# Altium project Power Board UCC28951.PrjPcb (part 1 of 4)
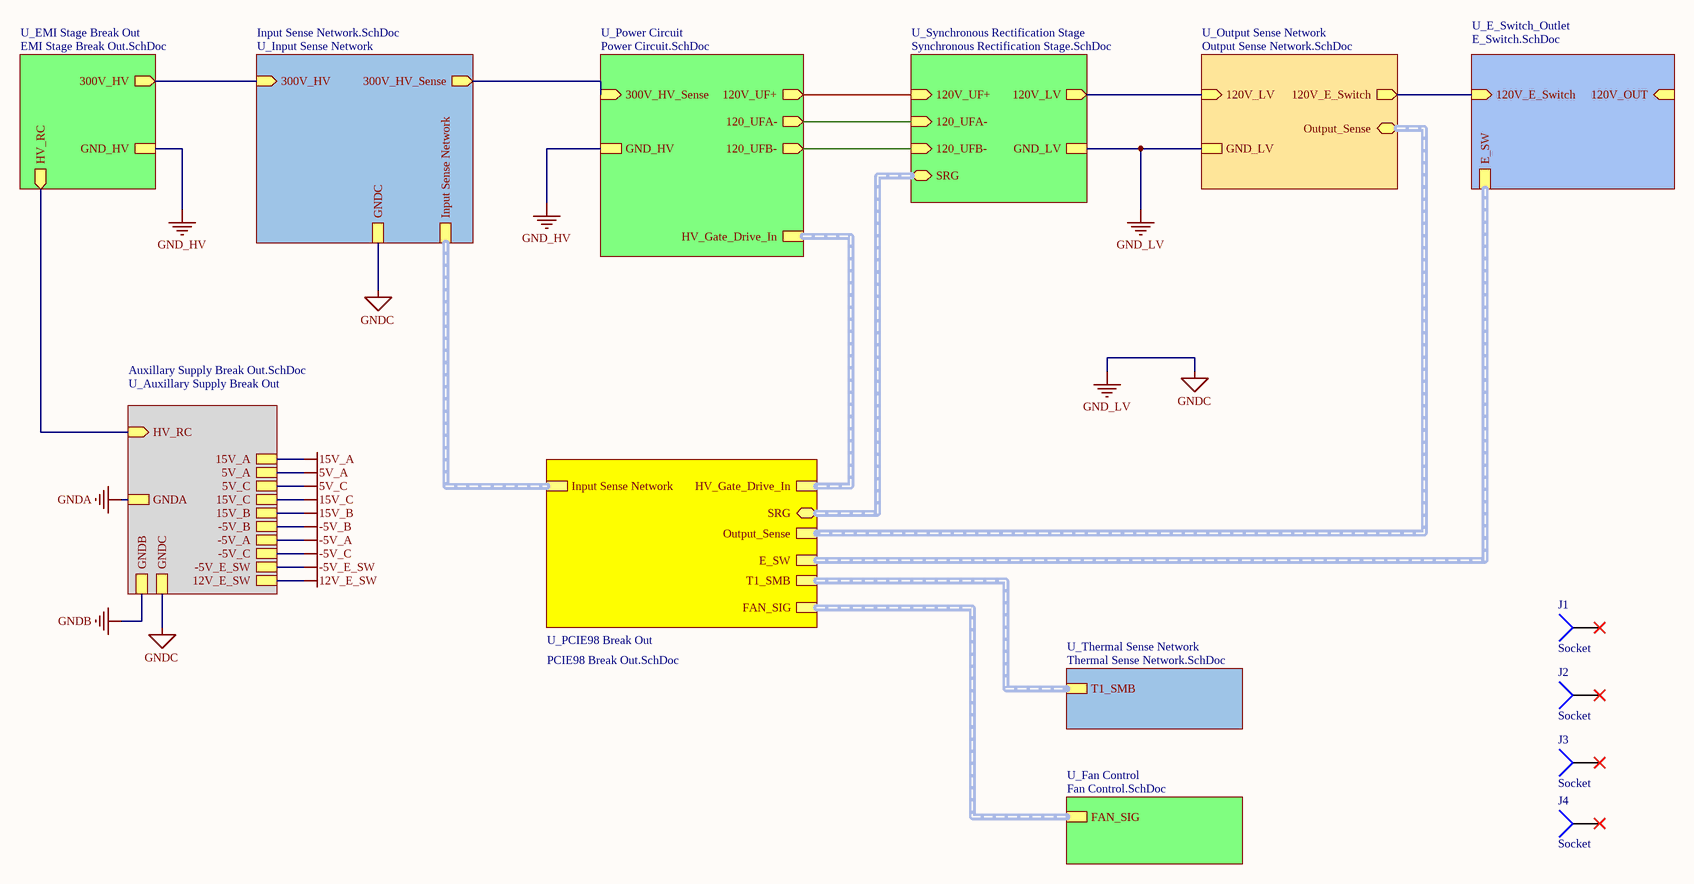
[diagram p0: Power Board UCC28951.SchDoc]
17 sheets, 569 parts. Net scope: hierarchical (ports join the sheet entries above them; power ports are global).
Board file: Power Board UCC28951.PcbDoc
Sheets:
  Power Board UCC28951.SchDoc
    U_Power Circuit = Power Circuit.SchDoc
      U_Gate Driver HV = Gate Driver HV.SchDoc
    U_PCIE98 Break Out = PCIE98 Break Out.SchDoc
    U_Auxillary Supply Break Out = Auxillary Supply Break Out.SchDoc
      U_5V_Isolated_Bias = 5V_Isolated_Bias.SchDoc
    U_EMI Stage Break Out = EMI Stage Break Out.SchDoc
    U_Thermal Sense Network = Thermal Sense Network.SchDoc
    U_Output Sense Network = Output Sense Network.SchDoc
      U_Output Current Sense = Output Current Sense.SchDoc
    U_Input Sense Network = Input Sense Network.SchDoc
      U_Input Current Sense = Input Current Sense.SchDoc
      U_Input Voltage Sense = Input Voltage Sense.SchDoc
    U_Synchronous Rectification Stage = Synchronous Rectification Stage.SchDoc
      U_Gate Driver Rectifier = Gate Driver Rectifier.SchDoc
    U_E_Switch_Outlet = E_Switch.SchDoc
    U_Fan Control = Fan Control.SchDoc

## Sheet Power Board UCC28951.SchDoc
size B

### Parts
J1  Socket  [Mounting_screw_3mm]
J2  Socket  [Mounting_screw_3mm]
J3  Socket  [Mounting_screw_3mm]
J4  Socket  [Mounting_screw_3mm]

### Sub-sheets
U_Auxillary Supply Break Out = Auxillary Supply Break Out.SchDoc: 15V_A, 5V_A, 15V_B, GNDB, GNDA, 5V_C, 15V_C, GNDC, -5V_B, -5V_A, -5V_C, -5V_E_SW, 12V_E_SW, HV_RC (in)
U_E_Switch_Outlet = E_Switch.SchDoc: 120V_E_Switch (in), 120V_OUT (in), E_SW (harness E_SW)
U_EMI Stage Break Out = EMI Stage Break Out.SchDoc: 300V_HV (out), GND_HV, HV_RC (out)
U_Fan Control = Fan Control.SchDoc: FAN_SIG (harness FAN_SIG)
U_Input Sense Network = Input Sense Network.SchDoc: 300V_HV (in), 300V_HV_Sense (out), GNDC, Input Sense Network (harness Input Sense Network)
U_Output Sense Network = Output Sense Network.SchDoc: 120V_LV (in), GND_LV, Output_Sense (bidir, harness Output_Sense), 120V_E_Switch (out)
U_PCIE98 Break Out = PCIE98 Break Out.SchDoc: Input Sense Network (harness Input Sense Network), HV_Gate_Drive_In (harness HV_Gate_Drive_In), SRG (bidir, harness SRG), Output_Sense (harness Output_Sense), E_SW (harness E_SW), T1_SMB (harness T1_SMB), FAN_SIG (harness FAN_SIG)
U_Power Circuit = Power Circuit.SchDoc: 300V_HV_Sense (in), GND_HV, 120V_UF+ (out), 120_UFA- (out), 120_UFB- (out), HV_Gate_Drive_In (harness HV_Gate_Drive_In)
U_Synchronous Rectification Stage = Synchronous Rectification Stage.SchDoc: 120V_UF+ (in), GND_LV, 120V_LV (out), 120_UFA- (in), 120_UFB- (in), SRG (bidir, harness SRG)
U_Thermal Sense Network = Thermal Sense Network.SchDoc: T1_SMB (harness T1_SMB)

### Nets
GND_HV: sheet U_Power Circuit/GND_HV, sheet U_EMI Stage Break Out/GND_HV
GND_LV: sheet U_Auxillary Supply Break Out/GNDC, sheet U_Output Sense Network/GND_LV, sheet U_Input Sense Network/GNDC, sheet U_Synchronous Rectification Stage/GND_LV  [also labelled GNDC]
120_UFA-: sheet U_Power Circuit/120_UFA-, sheet U_Synchronous Rectification Stage/120_UFA-
120_UFB-: sheet U_Power Circuit/120_UFB-, sheet U_Synchronous Rectification Stage/120_UFB-
120V_LV: sheet U_Power Circuit/120V_UF+, sheet U_Output Sense Network/120V_LV, sheet U_Synchronous Rectification Stage/120V_UF+, sheet U_Synchronous Rectification Stage/120V_LV
300V_HV: sheet U_EMI Stage Break Out/300V_HV, sheet U_Input Sense Network/300V_HV
300V_HV_Sense: sheet U_Power Circuit/300V_HV_Sense, sheet U_Input Sense Network/300V_HV_Sense
E_SW_Clamp: sheet U_Output Sense Network/120V_E_Switch, sheet U_E_Switch_Outlet/120V_E_Switch
HV_RC: sheet U_Auxillary Supply Break Out/HV_RC, sheet U_EMI Stage Break Out/HV_RC

Not connected (* = marked no-connect by the designer): J1 1*; J2 1*; J3 1*; J4 1*

### Buses and harness runs
harness  = sheet U_Input Sense Network/Input Sense Network = sheet U_PCIE98 Break Out/Input Sense Network
harness sheet U_E_Switch_Outlet/E_SW = sheet U_PCIE98 Break Out/E_SW
harness sheet U_Fan Control/FAN_SIG = sheet U_PCIE98 Break Out/FAN_SIG
harness sheet U_Output Sense Network/Output_Sense = sheet U_PCIE98 Break Out/Output_Sense
harness sheet U_PCIE98 Break Out/HV_Gate_Drive_In = sheet U_Power Circuit/HV_Gate_Drive_In
harness sheet U_PCIE98 Break Out/SRG = sheet U_Synchronous Rectification Stage/SRG
harness sheet U_PCIE98 Break Out/T1_SMB = sheet U_Thermal Sense Network/T1_SMB

### Library data of the parts
J1-J4 = Socket: LatestRevisionDate: 17-Jul-2002; LatestRevisionNote: Re-released for DXP Platform.; Publisher: Altium Limited

## Sheet Power Circuit.SchDoc
size A1
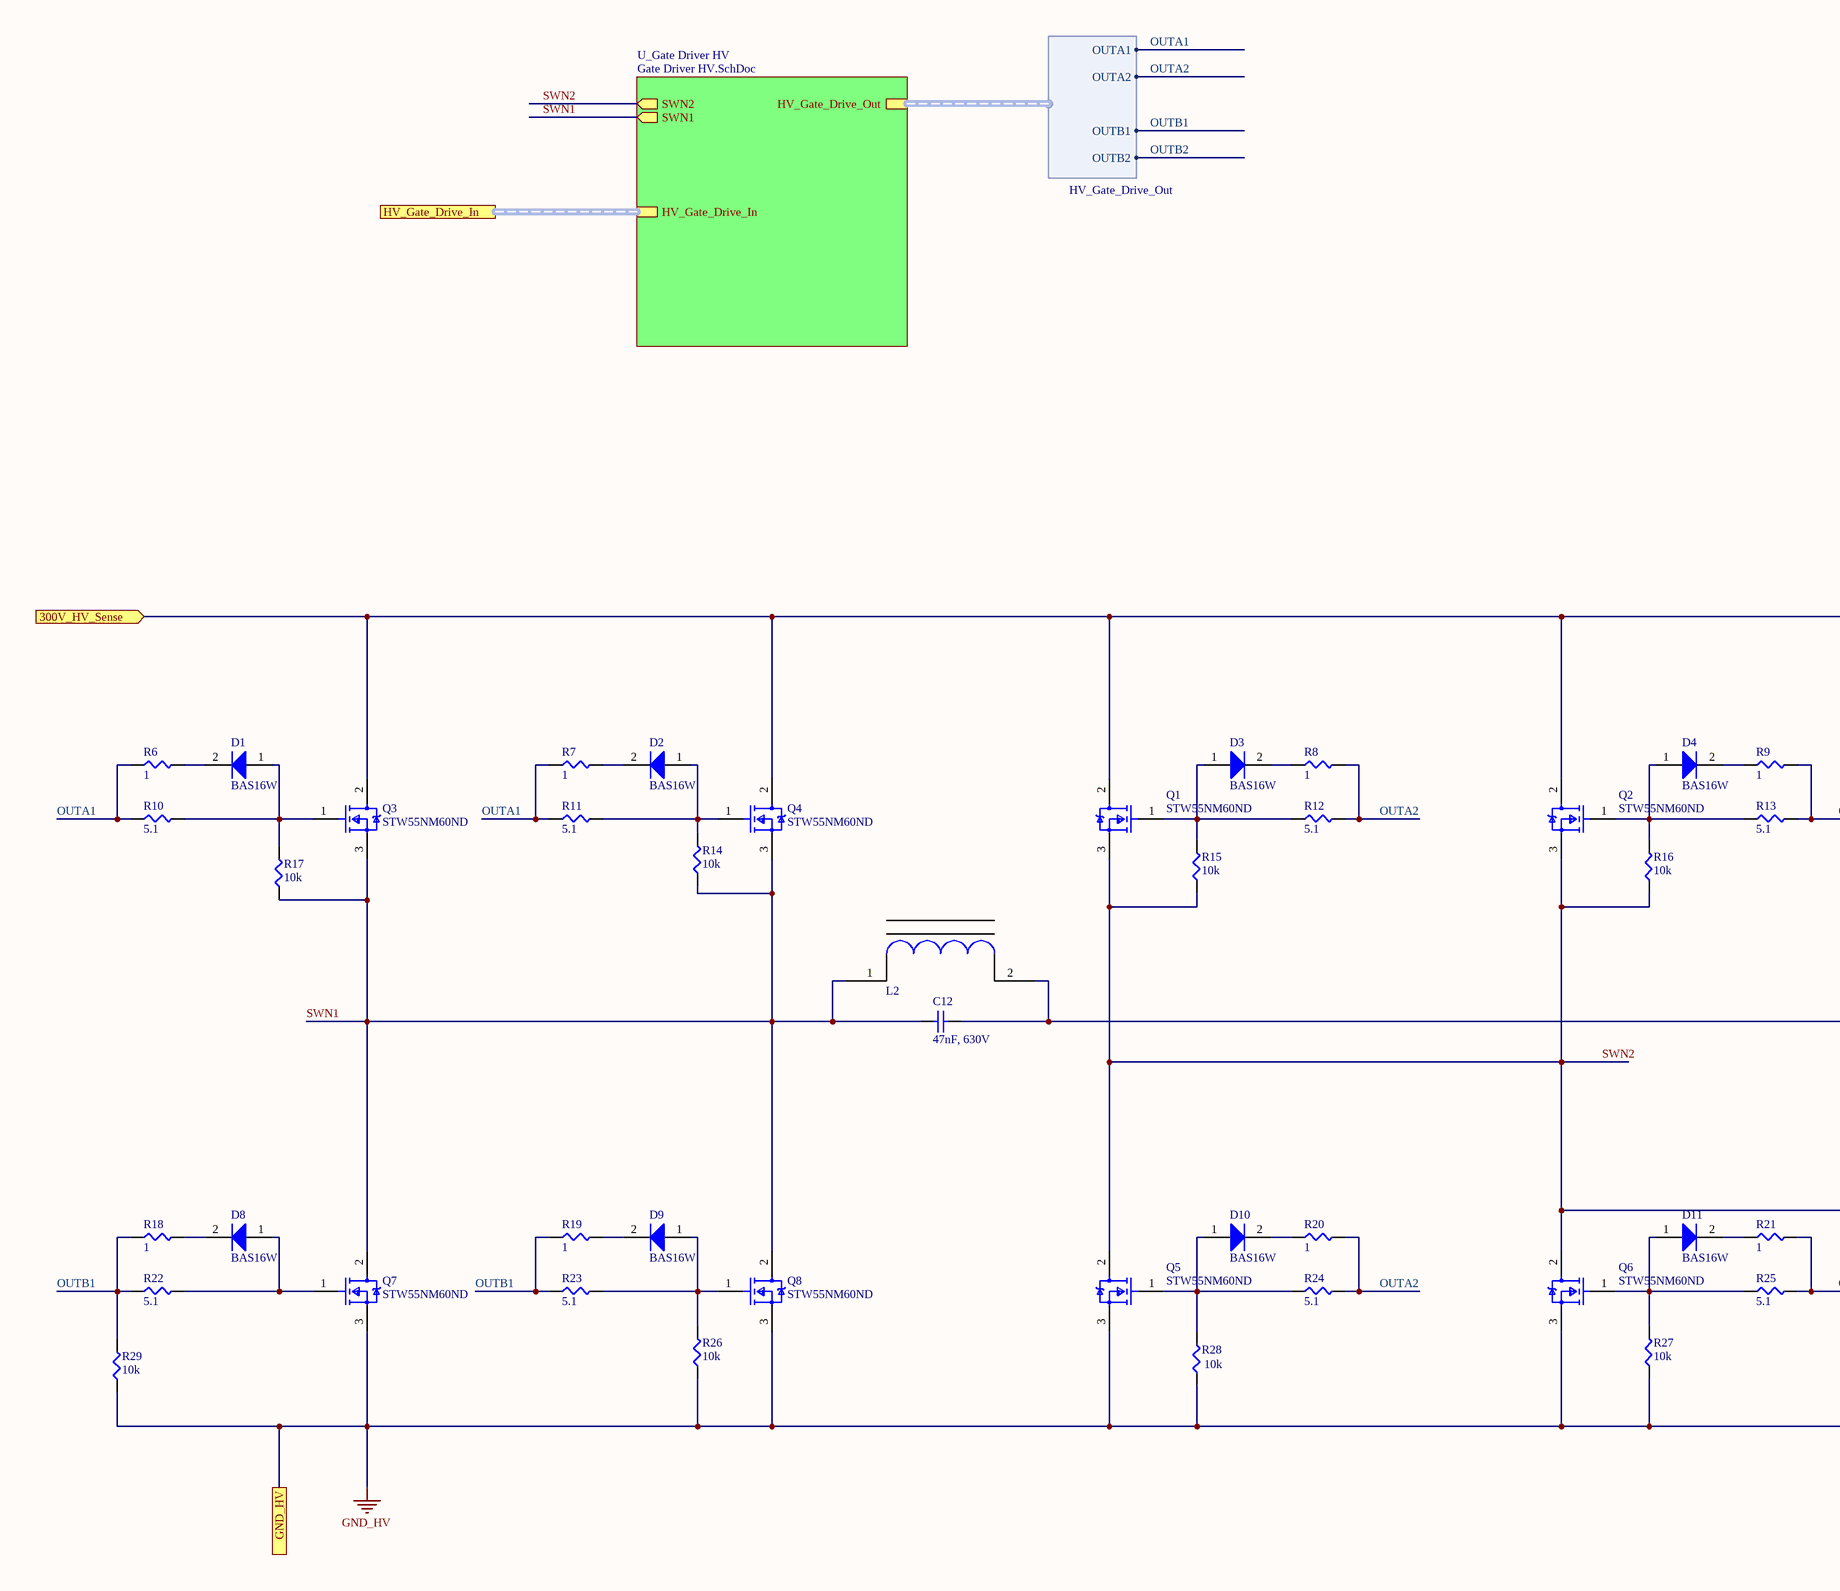
[diagram p1: Power Circuit.SchDoc, left]
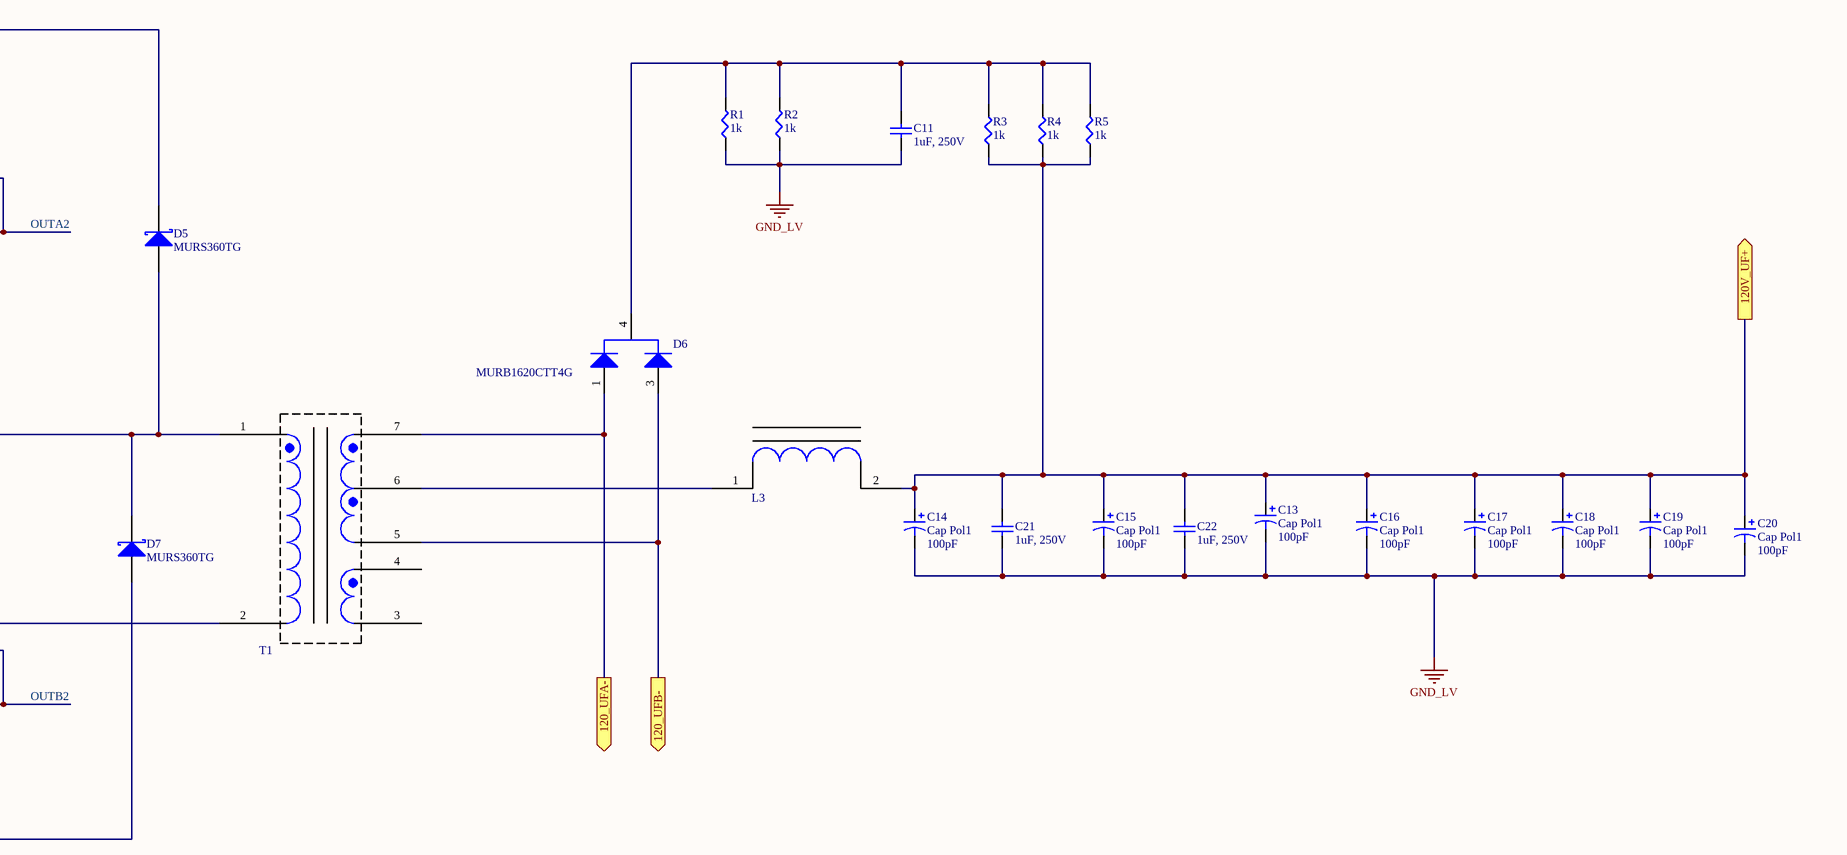
[diagram p2: Power Circuit.SchDoc, right]

### Parts
(Parts that share a designator on the sheet are numbered #1, #2 ... from top to bottom, then left to right.)
C11  1uF, 250V  [L18_W7_H13_P15]
C12  47nF, 630V  [L13_W5.5_H11_P10]
C13  Cap Pol1  value 100pF  [450V_25mm_Dia_10mm_pitch]
C14  Cap Pol1  value 100pF  [450V_25mm_Dia_10mm_pitch]
C15  Cap Pol1  value 100pF  [450V_25mm_Dia_10mm_pitch]
C16  Cap Pol1  value 100pF  [450V_25mm_Dia_10mm_pitch]
C17  Cap Pol1  value 100pF  [450V_25mm_Dia_10mm_pitch]
C18  Cap Pol1  value 100pF  [450V_25mm_Dia_10mm_pitch]
C19  Cap Pol1  value 100pF  [450V_25mm_Dia_10mm_pitch]
C20  Cap Pol1  value 100pF  [450V_25mm_Dia_10mm_pitch]
C21  1uF, 250V  [L18_W7_H13_P15]
C22  1uF, 250V  [L18_W7_H13_P15]
D1  BAS16W  [SODFL250X110-2N]
D2  BAS16W  [SODFL250X110-2N]
D3  BAS16W  [SODFL250X110-2N]
D4  BAS16W  [SODFL250X110-2N]
D5  MURS360TG  [VISH-DO-214AB-2_V]
D6  MURB1620CTT4G  [DPAK254P1542X450-3N - diode]
D7#1  MURS360TG  [VISH-DO-214AB-2_V]
D8  BAS16W  [SODFL250X110-2N]
D9  BAS16W  [SODFL250X110-2N]
D10  BAS16W  [SODFL250X110-2N]
D11  BAS16W  [SODFL250X110-2N]
L2  Transformer_Inductor  [Shim Inductor]  (value not drawn)
L3  Transformer_Inductor  [Toroid_54439_2]  (value not drawn)
Q1  STW55NM60ND  [FP-TO-247-0075325-MFG]
Q2  STW55NM60ND  [FP-TO-247-0075325-MFG]
Q3  STW55NM60ND  [FP-TO-247-0075325-MFG]
Q4  STW55NM60ND  [FP-TO-247-0075325-MFG]
Q5  STW55NM60ND  [FP-TO-247-0075325-MFG]
Q6  STW55NM60ND  [FP-TO-247-0075325-MFG]
Q7  STW55NM60ND  [FP-TO-247-0075325-MFG]
Q8  STW55NM60ND  [FP-TO-247-0075325-MFG]
R1  1k  [SMD-2512-RES]
R2  1k  [SMD-2512-RES]
R3  1k  [SMD-2512-RES]
R4  1k  [SMD-2512-RES]
R5  1k  [SMD-2512-RES]
R6  1  [SMD-0805-RES]
R7  1  [SMD-0805-RES]
R8  1  [SMD-0805-RES]
R9  1  [SMD-0805-RES]
R10  5.1  [SMD-1206-RES]
R11  5.1  [SMD-1206-RES]
R12  5.1  [SMD-1206-RES]
R13  5.1  [SMD-1206-RES]
R14  10k  [SMD-1206-RES]
R15  10k  [SMD-1206-RES]
R16  10k  [SMD-1206-RES]
R17  10k  [SMD-1206-RES]
R18  1  [SMD-0805-RES]
R19  1  [SMD-0805-RES]
R20  1  [SMD-0805-RES]
R21  1  [SMD-0805-RES]
R22  5.1  [SMD-1206-RES]
R23  5.1  [SMD-1206-RES]
R24  5.1  [SMD-1206-RES]
R25  5.1  [SMD-1206-RES]
R26  10k  [SMD-1206-RES]
R27  10k  [SMD-1206-RES]
R28  10k  [SMD-1206-RES]
R29  10k  [SMD-1206-RES]
T1  Transformer_Centre_Tap_Secondaru_Aux_1  [ETD59]  (value not drawn)

### Sub-sheets
U_Gate Driver HV = Gate Driver HV.SchDoc: HV_Gate_Drive_Out (harness HV_Gate_Drive_Out), HV_Gate_Drive_In (harness HV_Gate_Drive_In), SWN2 (out), SWN1 (out)

### Ports
120_UFA- (out), 120_UFB- (out), 120V_UF+ (out), 300V_HV_Sense (in), GND_HV, HV_Gate_Drive_In (harness HV_Gate_Drive_In)

### Harnesses
HV_Gate_Drive_Out: OUTA1, OUTA2, OUTB1, OUTB2

### Nets
GND_HV: D7#1.1(A) Q5.3(S) Q6.3(S) Q7.3(S) Q8.3(S) R26.1 R27.1 R28.1 R29.1 ; port GND_HV
GND_LV: C11.1 C13.2 C14.2 C15.2 C16.2 C17.2 C18.2 C19.2 C20.2 C21.1 C22.1 R1.1 R2.1
120_UFA-: D6.1(A1) T1.7 ; port 120_UFA-
120_UFB-: D6.3(A2) T1.5 ; port 120_UFB-
120V_LV: C13.1 C14.1 C15.1 C16.1 C17.1 C18.1 C19.1 C20.1 C21.2 C22.2 L3.2 R3.1 R4.1 R5.1 ; port 120V_UF+
300V_HV_Sense: D5.2(K) Q1.2(D) Q2.2(D) Q3.2(D) Q4.2(D) ; port 300V_HV_Sense
OUTA1: R6.1 R7.1 R10.1 R11.1 ; sheet U_Gate Driver HV/HV_Gate_Drive_Out.OUTA1
OUTA2: R8.2 R9.2 R12.2 R13.2 R20.2 R24.2 ; sheet U_Gate Driver HV/HV_Gate_Drive_Out.OUTA2
OUTB1: R18.1 R19.1 R22.1 R23.1 R29.2 ; sheet U_Gate Driver HV/HV_Gate_Drive_Out.OUTB1
OUTB2: R21.2 R25.2 ; sheet U_Gate Driver HV/HV_Gate_Drive_Out.OUTB2
SWN1: C12.1 L2.1 Q3.3(S) Q4.3(S) Q7.2(D) Q8.2(D) R14.1 R17.1 ; sheet U_Gate Driver HV/SWN1
SWN2: Q1.3(S) Q2.3(S) Q5.2(D) Q6.2(D) R15.1 R16.1 T1.2 ; sheet U_Gate Driver HV/SWN2
NetC11_2: C11.2 D6.4(K) R1.2 R2.2 R3.2 R4.2 R5.2
NetC12_2: C12.2 D5.1(A) D7#1.2(K) L2.2 T1.1
NetD1_1: D1.1(A) Q3.1(G) R10.2 R17.2
NetD1_2: D1.2(K) R6.2
NetD2_1: D2.1(A) Q4.1(G) R11.2 R14.2
NetD2_2: D2.2(K) R7.2
NetD3_1: D3.1(A) Q1.1(G) R12.1 R15.2
NetD3_2: D3.2(K) R8.1
NetD4_1: D4.1(A) Q2.1(G) R13.1 R16.2
NetD4_2: D4.2(K) R9.1
NetD8_1: D8.1(A) Q7.1(G) R22.2
NetD8_2: D8.2(K) R18.2
NetD9_1: D9.1(A) Q8.1(G) R23.2 R26.2
NetD9_2: D9.2(K) R19.2
NetD10_1: D10.1(A) Q5.1(G) R24.1 R28.2
NetD10_2: D10.2(K) R20.1
NetD11_1: D11.1(A) Q6.1(G) R25.1 R27.2
NetD11_2: D11.2(K) R21.1
NetL3_1: L3.1 T1.6

Not connected (* = marked no-connect by the designer): T1 3 4

### Buses and harness runs
harness port HV_Gate_Drive_In = sheet U_Gate Driver HV/HV_Gate_Drive_In

### Library data of the parts
C11 C21 C22 = 890273425007CS: WCAP-FTBE THT Film Capacitors, 1uF, 250VDC; Insulation Resistance: 3000Ohm x F; Dissipation Factor@100kHz: 4.3%; Dissipation Factor@1kHz: 1%; Dissipation Factor@10kHz: 1.5%; Pitch: 15mm; Rate of Voltage Rise: 11V/us; Technical Reference: MPSP015105K250DCPP45004; ComponentLink1Description: Manufacturer; ComponentLink1URL: http://www.we-online.de; ComponentLink2Description: Datasheet; ComponentLink2URL: https://katalog.we-online.com/pbs/datasheet/890273425007CS.pdf; Length: 18mm; Mounting Technology: THT; Packaging: Carton; Part Number: 890273425007CS; Operating Temperature: -40 to +85degC; Width: 7mm; Capacitance: 1uF; Height: 13mm; Rated Voltage: 250VDC; Publisher: Wurth Elektronik; Published Date: August 2019
C12 = 890303323004CS: WCAP-FTBP THT Film Capacitors, 47nF, 630VDC; Insulation Resistance: 30000MOhm; Dissipation Factor@100kHz: 0.29%; Dissipation Factor@1kHz: 0.1%; Dissipation Factor@10kHz: 10%; Pitch: 10mm; Rate of Voltage Rise: 430V/us; Technical Reference: MPPP010473J630DCPP55004; ComponentLink1Description: Manufacturer; ComponentLink1URL: http://www.we-online.de; ComponentLink2Description: Datasheet; ComponentLink2URL: https://katalog.we-online.com/pbs/datasheet/890303323004CS.pdf; Length: 13mm; Mounting Technology: THT; Packaging: Carton; Part Number: 890303323004CS; Operating Temperature: -40 to +105degC; Width: 5.5mm; Capacitance: 47nF; Height: 11mm; Rated Voltage: 630VDC; Publisher: Wurth Elektronik; Published Date: August 2019
C13-C20 = Cap Pol1: Polarized Capacitor (Radial); Published: 8-Jun-2000; LatestRevisionDate: 17-Jul-2002; LatestRevisionNote: Re-released for DXP Platform.; PackageReference: RB7.6-15; Publisher: Altium Limited; PackageDescription: Polarized Capacitor (Radial); 2 Leads
D1-D4 D8-D11 = BAS16_SOD: Silicon Switching Diode, SOT323, Reel, Green; Manufacturer: Infineon; IR (max): 100Â nA; Configuration: Single; VBR (min): 85Â V; VR (max): 80Â V; trr (max): 4Â ns; Green: TRUE; VF (max): 1.25Â V; IF (max): 250Â mA; Mounting Technology: Surface Mount; PackageReference: SOT323; ComponentLink2URL: http://www.infineon.com/dgdl/bas16series.pdf?folderId=db3a30431400ef6801141b5844e103ea&fileId=db3a30431400ef6801141b93811b03ff; Halogen-free: TRUE; ComponentLink2Description: Datasheet; PartNumber: BAS16W; ComponentLink1Description: Manufacturer URL; ComponentLink3URL: http://www.infineon.com/dgdl/SOT323-Package_Overview.pdf?folderId=db3a30431936bc4b0119533e1dcb3c92&fileId=db3a30431936bc4b011953495f283cb1; ComponentLink1URL: http://www.infineon.com/; PackageDescription: 3-Pin Small Outline Transistor Package, 1.25 x 2 mm Body, 0.65 mm Pitch; ComponentLink3Description: Package Specification
D5 D7#1 = CMP-2000-07150-1: Surface Mount Schottky Barrier Rectifier, 600 V, 3 A, -55 to 150 degC, 2-Pin SMC (DO-214AB), RoHS, Tape and Reel; Manufacturer: Vishay; Forward Current If(AV): 3A; Diode Configuration: Single; Forward Surge Current Ifsm Max: 100A; SVHC: ToBeAdvised; No. of Pins: 2Pins; Forward Voltage VF Max: 750mV; Repetitive Reverse Voltage Vrrm Max: 60V; Datasheet URL: http://www.vishay.com/docs/88751/ss32.pdf; Datasheet Version: 08/2015; Manufacturer URL: http://www.vishay.com/; Diode Type: Schottky; Package Reference: DO-214AB; Mounting Technology: SurfaceMount; Diode Case Style: DO-214AB; Package Description: 2-Pin Surface Mount Device, Body 6.855 x 5.905 mm; Packaging: CutTape; Operating Temperature Max: 150°C; Product Range: -
D6 = CMP-0902-00228-1: SWITCHMODE(TM) Power Rectifier, 3-Pin D2PAK, Pb-Free, Tape and Reel; Manufacturer: On Semiconductor; IFSM Max (A): 100; VRRM Max (V): 200; Type: Ultrafast; ComponentLink2URL: http://www.onsemi.cn/pub_link/Collateral/MURB1620CT-D.PDF; Mounting Technology: Surface Mount; PackageReference: D2PAK-3-418B-04; PackageDescription: 3-Pin Flange Mount, Body 9.145 x 9.97 mm, Pitch 2.54 mm; PackageVersion: Rev. K, 09/2008; RoHS: TRUE; PartNumber: MURB1620CTT4G; Packing: Tape and Reel; ComponentLink1URL: http://www.onsemi.com/; ComponentLink3Description: Package Specification; ComponentLink3URL: http://www.onsemi.com/pub_link/Collateral/418B-04.PDF; DatasheetVersion: Rev. 7; ComponentLink2Description: Datasheet; ComponentLink1Description: Manufacturer URL
Q1-Q8 = CMP-12198-000021-1: MOSFET N-CH 600V 51A TO-247; Obsolete Part: true; Manufacturer: STMicroelectronics; Max Forward Diode Voltage: 1.3V; Drain To Source Resistance: 0.047Ω; Turn Off Delay Time: 188ns; Threshold Vgs Min: 3V; Rthja Max: 50°C/W; Threshold Vgs Max: 5V; Transconductance: 45S; Depletion Mode: False; Turn On Delay Time: 33ns; Gate Charge At Vgs: 190nC @ 10V; Standoff Height: 3.7mm; Number Of Channels: 1; Gate To Source Voltage: 25V; Max Junction Temp: +150°C; Reverse Recovery Time: 200ns; Reverse Recovery Charge: 1800nC; Pulse Drain Current: 204A; Input Capacitace At Vds: 5800pF @ 50V; Power Dissipation: 350W; Automotive: No; RoHS: TRUE; Continuous Drain Current: 51A; ComponentLink2Description: Datasheet; Digikey Description: MOSFET N-CH 600V 51A TO-247; Device Class L1: Discrete Semiconductors; Package: TO-247-0075325; Height: 24.45mm; Manufacturer Part Number: STW55NM60ND; Drain To Source Voltage: 600V; ComponentLink2URL: https://www.mouser.in/datasheet/2/389/en.CD00176812-1218252.pdf; Temperature Range High: +150°C; Octopart: https://octopart.com/stw55nm60nd-stmicroelectronics-8600607; Category: Trans; Device Class L3: MOSFETs; Ipc Land Pattern Name: TO-220; Device Class L2: Transistors; Drain To Source Breakdown Voltage: 600V; Lead Free: Yes; Temperature: to +150°C; Mouser Description: MOSFET N-channel 600 V FDMesh; Number Of N Channels: 1
R1-R5 = ERJ-1TNF1001U: RES SMD 1K OHM 1% 1W 2512; Manufacturer: Panasonic Electronic Components; Factory Stock: 0; Unit Price (USD): 0.14799; @ qty: 1500; Minimum Quantity: 1; Temperature Coefficient: ±100ppm/°C; Part Number: ERJ-1TNF1001U; Datasheets: http://industrial.panasonic.com/www-cgi/jvcr13pz.cgi?E+PZ+3+AOA0002+ERJ1TNF1001U+7+WW; Image: //media.digikey.com/Renders/Panasonic%20Renders/ERJ-2512%20Pkg.jpg; Digi-Key Part Number: PT1.00KAFCT-ND; Quantity Available: 16384; Packaging: Cut Tape (CT); Series: ERJ; Part Status: Active; Value: 1k; Tolerance: ±1%; Power (Watts): 1W; Composition: Thick Film; Features: Automotive AEC-Q200; Operating Temperature: -55°C ~ 155°C; Package / Case: 2512 (6432 Metric); Supplier Device Package: 2512; Size / Dimension: 0.252" L x 0.126" W (6.40mm x 3.20mm); Height - Seated (Max): 0.028" (0.70mm); Number of Terminations: 2; Failure Rate: -
R6-R9 R18-R21 = ERJ-6BQF1R0V: RES SMD 1 OHM 1% 1/3W 0805; Manufacturer: Panasonic Electronic Components; Factory Stock: 0; Unit Price (USD): 0.05834; @ qty: 1500; Power (Watts): 0.333W, 1/3W; Temperature Coefficient: ±200ppm/°C; Part Number: ERJ-6BQF1R0V; Datasheets: https://industrial.panasonic.com/cdbs/www-data/pdf/RDA0000/AOA0000C239.pdf; Image: //media.digikey.com/Renders/Panasonic%20Renders/ERJ-0805%20Pkg.jpg; Digi-Key Part Number: P17499CT-ND; Quantity Available: 808; Minimum Quantity: 1; Packaging: Cut Tape (CT); Series: ERJ; Part Status: Active; Value: 1; Tolerance: ±1%; Composition: Thick Film; Features: Automotive AEC-Q200, Current Sense; Operating Temperature: -55°C ~ 125°C; Package / Case: 0805 (2012 Metric); Supplier Device Package: 0805; Size / Dimension: 0.079" L x 0.049" W (2.00mm x 1.25mm); Height - Seated (Max): 0.028" (0.70mm); Number of Terminations: 2; Failure Rate: -
R10-R13 R22-R25 = ERJ-8BQF5R1V: RES SMD 5.1 OHM 1% 1/2W 1206; Manufacturer: Panasonic Electronic Components; Factory Stock: 0; Unit Price (USD): 0.05778; @ qty: 1500; Minimum Quantity: 1; Power (Watts): 0.5W, 1/2W; Temperature Coefficient: ±200ppm/°C; Part Number: ERJ-8BQF5R1V; Datasheets: https://industrial.panasonic.com/cdbs/www-data/pdf/RDA0000/AOA0000C239.pdf; Image: //media.digikey.com/Renders/Panasonic%20Renders/ERJ-1206%20Pkg.jpg; Digi-Key Part Number: P17617CT-ND; Quantity Available: 4802; Packaging: Cut Tape (CT); Series: ERJ; Part Status: Active; Value: 5.1; Tolerance: ±1%; Composition: Thick Film; Features: Automotive AEC-Q200, Current Sense; Operating Temperature: -55°C ~ 125°C; Package / Case: 1206 (3216 Metric); Supplier Device Package: 1206; Size / Dimension: 0.126" L x 0.063" W (3.20mm x 1.60mm); Height - Seated (Max): 0.028" (0.70mm); Number of Terminations: 2; Failure Rate: -
R14-R17 R26-R29 = ERJ-8ENF1002V: RES SMD 10K OHM 1% 1/4W 1206; Manufacturer: Panasonic Electronic Components; Factory Stock: 0; Unit Price (USD): 0.00933; @ qty: 1500; Minimum Quantity: 1; Power (Watts): 0.25W, 1/4W; Temperature Coefficient: ±100ppm/°C; Part Number: ERJ-8ENF1002V; Datasheets: http://industrial.panasonic.com/www-cgi/jvcr13pz.cgi?E+PZ+3+AOA0002+ERJ8ENF1002V+7+WW; Image: //media.digikey.com/Renders/Panasonic%20Renders/ERJ-1206%20Pkg.jpg; Digi-Key Part Number: P10.0KFCT-ND; Quantity Available: 1108398; Packaging: Cut Tape (CT); Series: ERJ; Part Status: Active; Value: 10k; Tolerance: ±1%; Composition: Thick Film; Features: Automotive AEC-Q200; Operating Temperature: -55°C ~ 155°C; Package / Case: 1206 (3216 Metric); Supplier Device Package: 1206; Size / Dimension: 0.126" L x 0.063" W (3.20mm x 1.60mm); Height - Seated (Max): 0.028" (0.70mm); Number of Terminations: 2; Failure Rate: -

## Sheet Gate Driver HV.SchDoc
size A2
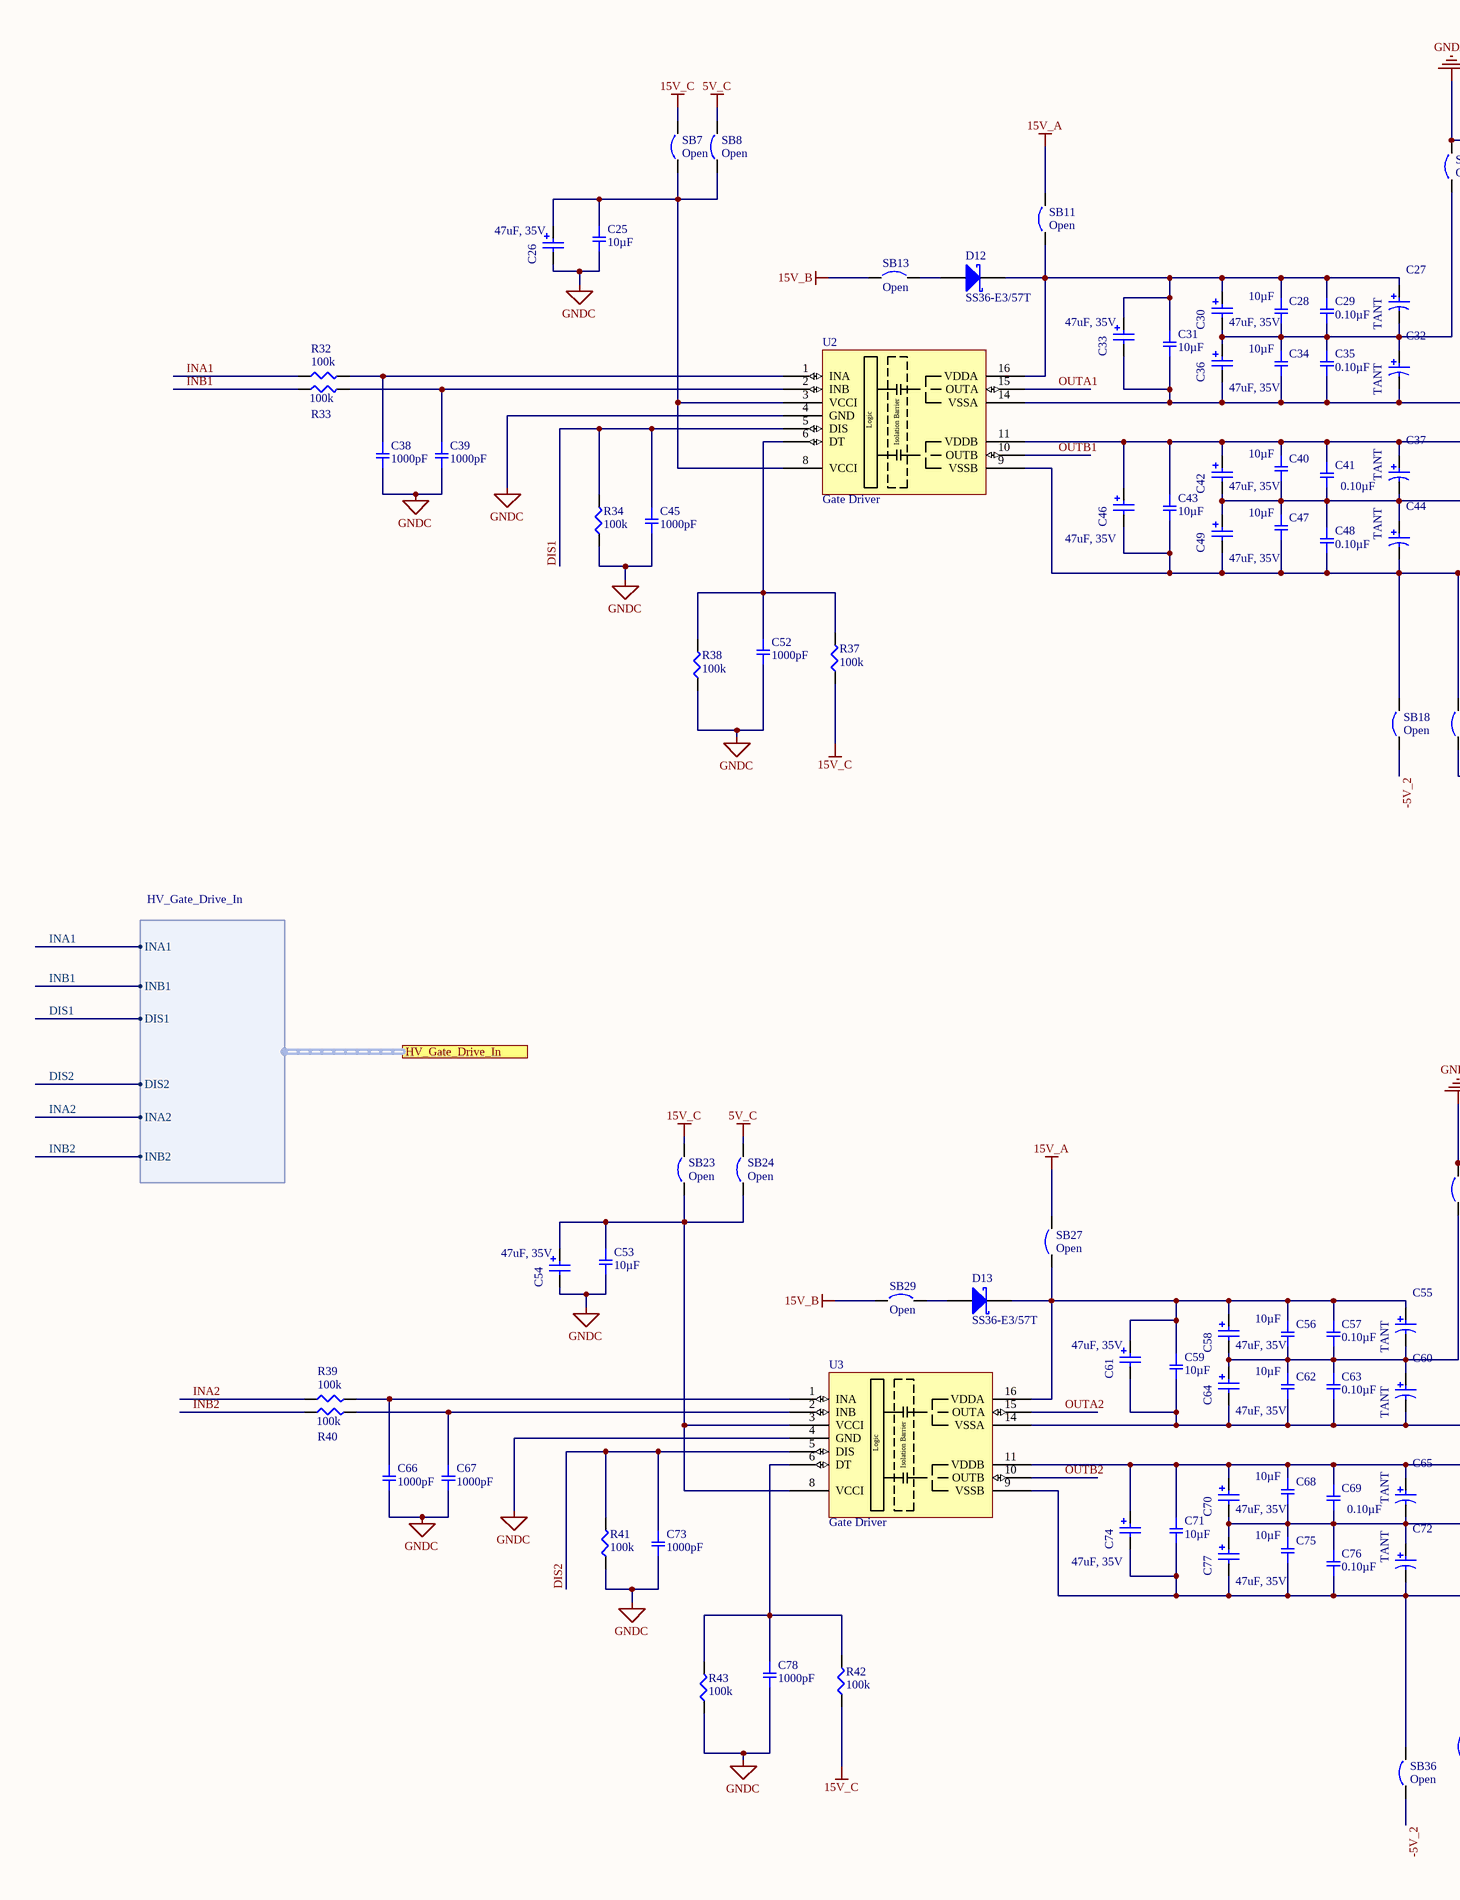
[diagram p3: Gate Driver HV.SchDoc, left]
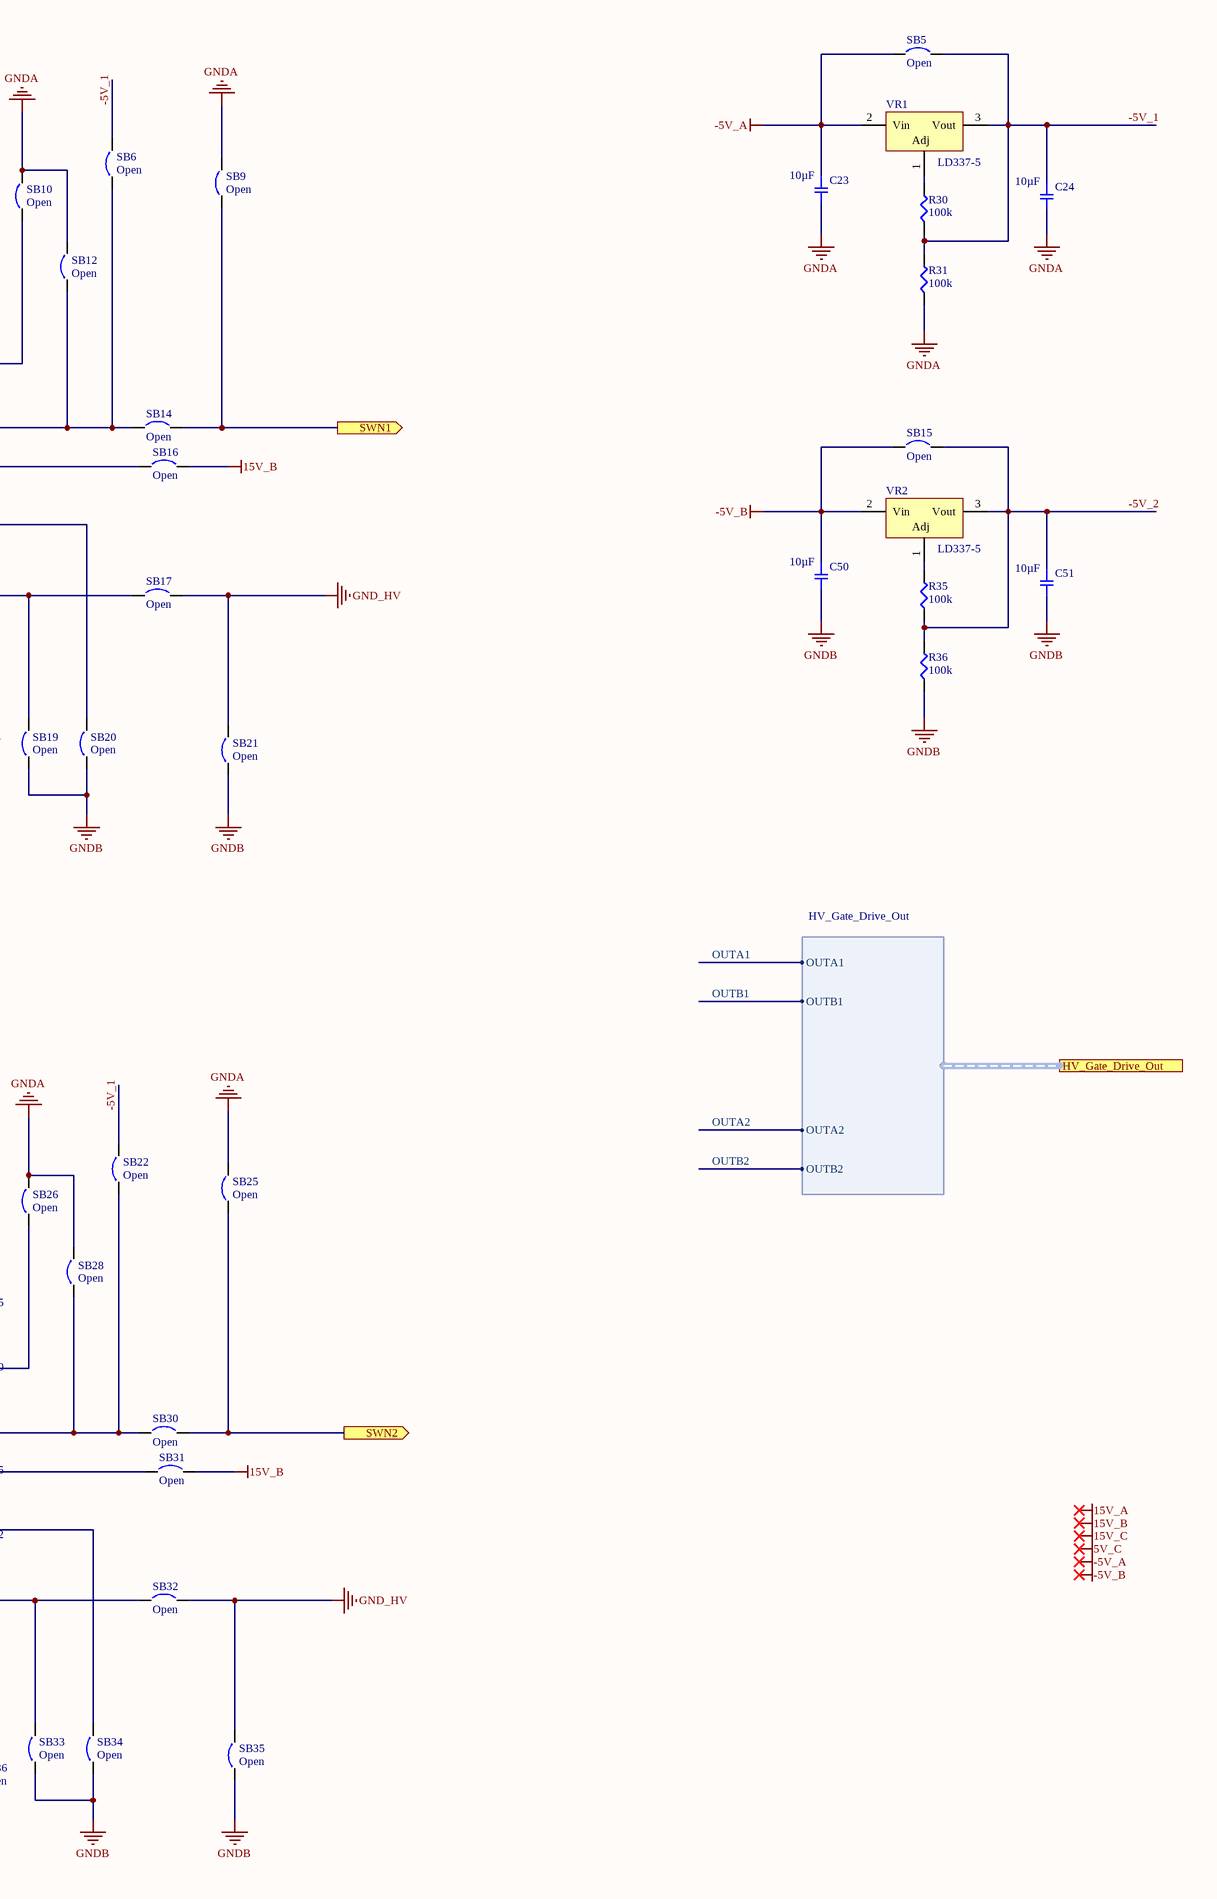
[diagram p4: Gate Driver HV.SchDoc, right]

### Parts
C23  10µF  [SMD-1206C]
C24  10µF  [SMD-1206C]
C25  10µF  [SMD-1206C]
C26  47uF, 35V  [WCAP-ASLL_6.3x5.5]
C27  TANT  [KEMT-T491-D_L]
C28  10µF  [SMD-1206C]
C29  0.10µF  [SMD-1206C]
C30  47uF, 35V  [WCAP-ASLL_6.3x5.5]
C31  10µF  [SMD-1206C]
C32  TANT  [KEMT-T491-D_L]
C33  47uF, 35V  [WCAP-ASLL_6.3x5.5]
C34  10µF  [SMD-1206C]
C35  0.10µF  [SMD-1206C]
C36  47uF, 35V  [WCAP-ASLL_6.3x5.5]
C37  TANT  [KEMT-T491-D_L]
C38  1000pF  [SMD-0805C]
C39  1000pF  [SMD-0805C]
C40  10µF  [SMD-1206C]
C41  0.10µF  [SMD-1206C]
C42  47uF, 35V  [WCAP-ASLL_6.3x5.5]
C43  10µF  [SMD-1206C]
C44  TANT  [KEMT-T491-D_L]
C45  1000pF  [SMD-0805C]
C46  47uF, 35V  [WCAP-ASLL_6.3x5.5]
C47  10µF  [SMD-1206C]
C48  0.10µF  [SMD-1206C]
C49  47uF, 35V  [WCAP-ASLL_6.3x5.5]
C50  10µF  [SMD-1206C]
C51  10µF  [SMD-1206C]
C52  1000pF  [SMD-0805C]
C53  10µF  [SMD-1206C]
C54  47uF, 35V  [WCAP-ASLL_6.3x5.5]
C55  TANT  [KEMT-T491-D_L]
C56  10µF  [SMD-1206C]
C57  0.10µF  [SMD-1206C]
C58  47uF, 35V  [WCAP-ASLL_6.3x5.5]
C59  10µF  [SMD-1206C]
C60  TANT  [KEMT-T491-D_L]
C61  47uF, 35V  [WCAP-ASLL_6.3x5.5]
C62  10µF  [SMD-1206C]
C63  0.10µF  [SMD-1206C]
C64  47uF, 35V  [WCAP-ASLL_6.3x5.5]
C65  TANT  [KEMT-T491-D_L]
C66  1000pF  [SMD-0805C]
C67  1000pF  [SMD-0805C]
C68  10µF  [SMD-1206C]
C69  0.10µF  [SMD-1206C]
C70  47uF, 35V  [WCAP-ASLL_6.3x5.5]
C71  10µF  [SMD-1206C]
C72  TANT  [KEMT-T491-D_L]
C73  1000pF  [SMD-0805C]
C74  47uF, 35V  [WCAP-ASLL_6.3x5.5]
C75  10µF  [SMD-1206C]
C76  0.10µF  [SMD-1206C]
C77  47uF, 35V  [WCAP-ASLL_6.3x5.5]
C78  1000pF  [SMD-0805C]
D12  SS36-E3/57T  [VISH-DO-214AB-2_V]
D13  SS36-E3/57T  [VISH-DO-214AB-2_V]
R30  100k  [SMD-0805-RES]
R31  100k  [SMD-0805-RES]
R32  100k  [SMD-0805-RES]
R33  100k  [SMD-0805-RES]
R34  100k  [SMD-0805-RES]
R35  100k  [SMD-0805-RES]
R36  100k  [SMD-0805-RES]
R37  100k  [SMD-0805-RES]
R38  100k  [SMD-0805-RES]
R39  100k  [SMD-0805-RES]
R40  100k  [SMD-0805-RES]
R41  100k  [SMD-0805-RES]
R42  100k  [SMD-0805-RES]
R43  100k  [SMD-0805-RES]
SB5  Open  [SB_0603]  (no BOM)
SB6  Open  [SB_0603]  (no BOM)
SB7  Open  [SB_0603]  (no BOM)
SB8  Open  [SB_0603]  (no BOM)
SB9  Open  [SB_0603]  (no BOM)
SB10  Open  [SB_0603]  (no BOM)
SB11  Open  [SB_0603]  (no BOM)
SB12  Open  [SB_0603]  (no BOM)
SB13  Open  [SB_0603]  (no BOM)
SB14  Open  [SB_0603]  (no BOM)
SB15  Open  [SB_0603]  (no BOM)
SB16  Open  [SB_0603]  (no BOM)
SB17  Open  [SB_0603]  (no BOM)
SB18  Open  [SB_0603]  (no BOM)
SB19  Open  [SB_0603]  (no BOM)
SB20  Open  [SB_0603]  (no BOM)
SB21  Open  [SB_0603]  (no BOM)
SB22  Open  [SB_0603]  (no BOM)
SB23  Open  [SB_0603]  (no BOM)
SB24  Open  [SB_0603]  (no BOM)
SB25  Open  [SB_0603]  (no BOM)
SB26  Open  [SB_0603]  (no BOM)
SB27  Open  [SB_0603]  (no BOM)
SB28  Open  [SB_0603]  (no BOM)
SB29  Open  [SB_0603]  (no BOM)
SB30  Open  [SB_0603]  (no BOM)
SB31  Open  [SB_0603]  (no BOM)
SB32  Open  [SB_0603]  (no BOM)
SB33  Open  [SB_0603]  (no BOM)
SB34  Open  [SB_0603]  (no BOM)
SB35  Open  [SB_0603]  (no BOM)
SB36  Open  [SB_0603]  (no BOM)
U2  Gate Driver  [SOIC127P1030X265_HS-17N]
U3  Gate Driver  [SOIC127P1030X265_HS-17N]
VR1  LD337-5  [SOT230P700X180-4N]
VR2  LD337-5  [SOT230P700X180-4N]

### Ports
HV_Gate_Drive_In (harness HV_Gate_Drive_In), HV_Gate_Drive_Out (harness HV_Gate_Drive_Out), SWN1 (out), SWN2 (out)

### Harnesses
HV_Gate_Drive_Out: OUTA1, OUTB1, OUTA2, OUTB2
HV_Gate_Drive_In: INA1, INB1, INA2, INB2, DIS2, DIS1

### Nets
5V_C: SB8.2 SB24.2
15V_A: SB11.2 SB27.2
15V_B: SB13.1 SB16.2 SB29.1 SB31.2
15V_C: R37.1 R42.1 SB7.2 SB23.2
-5V_A: C23.1 SB5.1 VR1.2(Vin)
-5V_B: C50.1 SB15.1 VR2.2(Vin)
GND_HV: SB17.2 SB21.2 SB32.2 SB35.2
GNDA: C23.2 C24.2 R31.1 SB9.2 SB10.2 SB12.2 SB25.2 SB26.2 SB28.2
GNDB: C50.2 C51.2 R36.1 SB19.1 SB20.1 SB21.1 SB33.1 SB34.1 SB35.1
GNDC: C25.2 C26.1(N) C38.2 C39.2 C45.2 C52.2 C53.2 C54.1(N) C66.2 C67.2 C73.2 C78.2 R34.1 R38.1 R41.1 R43.1 U2.4(GND) U3.4(GND)  [project net GND_LV]
-5V_1: C24.1 R30.1 R31.2 SB5.2 SB6.2 SB22.2 VR1.3(Vout)
-5V_2: C51.1 R35.1 R36.2 SB15.2 SB18.1 SB36.1 VR2.3(Vout)
DIS1: C45.1 R34.2 U2.5(DIS) ; port HV_Gate_Drive_In.DIS1
DIS2: C73.1 R41.2 U3.5(DIS) ; port HV_Gate_Drive_In.DIS2
INA1: R32.1 ; port HV_Gate_Drive_In.INA1
INA2: R39.1 ; port HV_Gate_Drive_In.INA2
INB1: R33.1 ; port HV_Gate_Drive_In.INB1
INB2: R40.1 ; port HV_Gate_Drive_In.INB2
OUTA1: U2.15(OUTA) ; port HV_Gate_Drive_Out.OUTA1
OUTA2: U3.15(OUTA) ; port HV_Gate_Drive_Out.OUTA2
OUTB1: U2.10(OUTB) ; port HV_Gate_Drive_Out.OUTB1
OUTB2: U3.10(OUTB) ; port HV_Gate_Drive_Out.OUTB2
SWN1: SB9.1 SB14.2 ; port SWN1
SWN2: SB25.1 SB30.2 ; port SWN2
NetC25_1: C25.1 C26.2(P) SB7.1 SB8.1 U2.3(VCCI) U2.8(VCCI)
NetC27_1: C27.1 C28.1 C29.1 C30.2(P) C31.1 C33.2(P) D12.2(K) SB11.1 U2.16(VDDA)
NetC27_2: C27.2 C28.2 C29.2 C30.1(N) C32.1 C34.1 C35.1 C36.2(P) SB10.1
NetC31_2: C31.2 C32.2 C33.1(N) C34.2 C35.2 C36.1(N) SB6.1 SB12.1 SB14.1 U2.14(VSSA)
NetC37_1: C37.1 C40.1 C41.1 C42.2(P) C43.1 C46.2(P) SB16.1 U2.11(VDDB)
NetC37_2: C37.2 C40.2 C41.2 C42.1(N) C44.1 C47.1 C48.1 C49.2(P) SB20.2
NetC38_1: C38.1 R32.2 U2.1(INA)
NetC39_1: C39.1 R33.2 U2.2(INB)
NetC43_2: C43.2 C44.2 C46.1(N) C47.2 C48.2 C49.1(N) SB17.1 SB18.2 SB19.2 U2.9(VSSB)
NetC52_1: C52.1 R37.2 R38.2 U2.6(DT)
NetC53_1: C53.1 C54.2(P) SB23.1 SB24.1 U3.3(VCCI) U3.8(VCCI)
NetC55_1: C55.1 C56.1 C57.1 C58.2(P) C59.1 C61.2(P) D13.2(K) SB27.1 U3.16(VDDA)
NetC55_2: C55.2 C56.2 C57.2 C58.1(N) C60.1 C62.1 C63.1 C64.2(P) SB26.1
NetC59_2: C59.2 C60.2 C61.1(N) C62.2 C63.2 C64.1(N) SB22.1 SB28.1 SB30.1 U3.14(VSSA)
NetC65_1: C65.1 C68.1 C69.1 C70.2(P) C71.1 C74.2(P) SB31.1 U3.11(VDDB)
NetC65_2: C65.2 C68.2 C69.2 C70.1(N) C72.1 C75.1 C76.1 C77.2(P) SB34.2
NetC66_1: C66.1 R39.2 U3.1(INA)
NetC67_1: C67.1 R40.2 U3.2(INB)
NetC71_2: C71.2 C72.2 C74.1(N) C75.2 C76.2 C77.1(N) SB32.1 SB33.2 SB36.2 U3.9(VSSB)
NetC78_1: C78.1 R42.2 R43.2 U3.6(DT)
NetD12_1: D12.1(A) SB13.2
NetD13_1: D13.1(A) SB29.2
NetR30_2: R30.2 VR1.1(Adj)
NetR35_2: R35.2 VR2.1(Adj)

### Notes on the sheet
- Labels drawn without touching a wire or pin: 5V_C, 15V_A, 15V_B, 15V_C, -5V_A, -5V_B
- (in symbol Gate Driver) Logic; Isolation Barrier

### Library data of the parts
C23-C25 C28 C31 C34 C40 C43 C47 C50 C51 C53 C56 C59 C62 C68 C71 C75 = GCJ31CR71A106KA13L: CAP CER 10UF 10V X7R 1206; Manufacturer: Murata Electronics North America; Factory Stock: 0; Unit Price (USD): 0.71; Minimum Quantity: 1; Tolerance: ±10%; Datasheets: http://www.murata.com/~/media/webrenewal/support/library/catalog/products/capacitor/mlcc/c03e.ashx; Image: //media.digikey.com/Renders/Murata%20Renders/GR331BD72E473KW01L.jpg; Digi-Key Part Number: 490-5848-1-ND; Part Number: GCJ31CR71A106KA13L; Quantity Available: 33084; @ qty: 0; Packaging: Cut Tape (CT); Series: GCJ; Part Status: Active; Value: 10µF; Voltage: 10V; Temperature Coefficient: X7R; Operating Temperature: -55°C ~ 125°C; Features: Soft Termination; Ratings: AEC-Q200; Applications: Automotive, Boardflex Sensitive; Mounting Type: Surface Mount, MLCC; Package / Case: 1206 (3216 Metric); Size / Dimension: 0.126" L x 0.063" W (3.20mm x 1.60mm); Height - Seated (Max): -; Thickness (Max): 0.063" (1.60mm); Lead Spacing: -; Lead Style: -
C26 C30 C33 C36 C42 C46 C49 C54 C58 C61 C64 C70 C74 C77 = 865060543005: WCAP-ASLL SMT Aluminum Electrolytic Capacitors, D6.3mm x L5.5mm, 47uF, +/-20%, 35VDC; Dissipation Factor: 14%; Endurance: 2000h; Leakage Current: 16.45uA; Ripple Current max.: 240mA; Technical Reference: ASED055470M035DVCTBB000; ComponentLink1Description: Manufacturer; ComponentLink1URL: http://www.we-online.de; ComponentLink2Description: Datasheet; ComponentLink2URL: https://katalog.we-online.com/pbs/datasheet/865060543005.pdf; Length: 5.5mm; Mounting Technology: SMT; Operating Temperature: -55 to +105degC; Packaging: Tape and Reel; Published Date: August 2019; Capacitance: 47uF; Diameter: 6.3mm; Part Number: 865060543005; Publisher: Wurth Elektronik; Capacitance Tolerance: +/-20%; Rated Voltage: 35VDC
C27 C32 C37 C44 C55 C60 C65 C72 = CMP-2000-07580-1: Tantalum Capacitor, 10 uF, +/- 10%, 35 V, -55 to 125 degC, 2-Pin SMD, RoHS, Tape and Reel; Manufacturer: Kemet; Capacitance: 10uF; Leakage Current: 3.5uA; Dissipation Factor: 6%; Case\/Package: 2917; Polarity: Polar; Voltage Rating: 35V; ESR (Equivalent Series Resistance): 1Ohm; Life (Hours): 2000Hour; Tolerance: 20%; Max Operating Temperature: 125degC; Length: 7.3mm; Depth: 4.3mm; Termination: SMD/SMT; Case Code (Metric): 7343; Number of Pins: 2; Package Reference: T491-D; Width: 4.3mm; RoHSCompliant: True; Lead Free: LeadFree; Radiation Hardening: No; Height: 2.8mm; Voltage Rating (DC): 35V; REACH SVHC: NoSVHC; Datasheet URL: http://www.kemet.com/Lists/ProductCatalog/Attachments/254/KEM_T2005_T491.pdf; Datasheet Version: 07/2017; Manufacturer URL: http://www.kemet.com/; Mounting Technology: SurfaceMount; Min Operating Temperature: -55degC; Case Code (Imperial): 2917; Package Quantity: 1; Packaging: TapeandReel; Package Description: 2-Pin Surface Mount Device, Body 7.3 x 4.3 mm; Height - Seated (Max): 0.122inch; Voltage: 35V; Dielectric Material: Tantalum; Mount: PCB
C29 C35 C41 C48 C57 C63 C69 C76 = GCJ31CR72E104KXJ3L: CAP CER 0.1UF 250V X7R 1206; Manufacturer: Murata Electronics North America; Factory Stock: 0; Unit Price (USD): 0.36; Minimum Quantity: 1; Tolerance: ±10%; Datasheets: http://www.murata.com/~/media/webrenewal/support/library/catalog/products/capacitor/mlcc/c03e.ashx; Image: //media.digikey.com/Renders/Murata%20Renders/GR331BD72E473KW01L.jpg; Digi-Key Part Number: 490-12647-1-ND; Part Number: GCJ31CR72E104KXJ3L; Quantity Available: 3645; @ qty: 0; Packaging: Cut Tape (CT); Series: GCJ; Part Status: Active; Value: 0.10µF; Voltage: 250V; Temperature Coefficient: X7R; Operating Temperature: -55°C ~ 125°C; Features: Soft Termination; Ratings: AEC-Q200; Applications: Automotive, Boardflex Sensitive; Mounting Type: Surface Mount, MLCC; Package / Case: 1206 (3216 Metric); Size / Dimension: 0.126" L x 0.063" W (3.20mm x 1.60mm); Height - Seated (Max): -; Thickness (Max): 0.071" (1.80mm); Lead Spacing: -; Lead Style: -
C38 C39 C45 C52 C66 C67 C73 C78 = GCJ216R72A102KA01D: CAP CER 1000PF 100V X7R 0805; Manufacturer: Murata Electronics North America; Factory Stock: 0; Unit Price (USD): 0.25; Minimum Quantity: 1; Tolerance: ±10%; Datasheets: http://www.murata.com/~/media/webrenewal/support/library/catalog/products/capacitor/mlcc/c03e.ashx; Image: //media.digikey.com/Renders/Murata%20Renders/0805%20(2012%20Metric)%20.85mm.jpg; Digi-Key Part Number: 490-5818-1-ND; Part Number: GCJ216R72A102KA01D; Quantity Available: 9725; @ qty: 0; Packaging: Cut Tape (CT); Series: GCJ; Part Status: Active; Value: 1000pF; Voltage: 100V; Temperature Coefficient: X7R; Operating Temperature: -55°C ~ 125°C; Features: Soft Termination; Ratings: AEC-Q200; Applications: Automotive, Boardflex Sensitive; Mounting Type: Surface Mount, MLCC; Package / Case: 0805 (2012 Metric); Size / Dimension: 0.079" L x 0.049" W (2.00mm x 1.25mm); Height - Seated (Max): -; Thickness (Max): 0.024" (0.60mm); Lead Spacing: -; Lead Style: -
D12 D13 = CMP-2000-07150-1: Surface Mount Schottky Barrier Rectifier, 60 V, 3 A, -55 to 150 degC, 2-Pin SMC (DO-214AB), RoHS, Tape and Reel; Manufacturer: Vishay; Forward Current If(AV): 3A; Diode Configuration: Single; Forward Surge Current Ifsm Max: 100A; SVHC: ToBeAdvised; No. of Pins: 2Pins; Forward Voltage VF Max: 750mV; Repetitive Reverse Voltage Vrrm Max: 60V; Datasheet URL: http://www.vishay.com/docs/88751/ss32.pdf; Datasheet Version: 08/2015; Manufacturer URL: http://www.vishay.com/; Diode Type: Schottky; Package Reference: DO-214AB; Mounting Technology: SurfaceMount; Diode Case Style: DO-214AB; Package Description: 2-Pin Surface Mount Device, Body 6.855 x 5.905 mm; Packaging: CutTape; Operating Temperature Max: 150°C; Product Range: -
R30-R43 = ERJ-6ENF1003V: RES SMD 100K OHM 1% 1/8W 0805; Manufacturer: Panasonic Electronic Components; Factory Stock: 0; Unit Price (USD): 0.00729; @ qty: 1500; Minimum Quantity: 1; Power (Watts): 0.125W, 1/8W; Temperature Coefficient: ±100ppm/°C; Part Number: ERJ-6ENF1003V; Datasheets: http://industrial.panasonic.com/www-cgi/jvcr13pz.cgi?E+PZ+3+AOA0002+ERJ6ENF1003V+7+WW; Image: //media.digikey.com/Renders/Panasonic%20Renders/ERJ-0805%20Pkg.jpg; Digi-Key Part Number: P100KCCT-ND; Quantity Available: 760677; Packaging: Cut Tape (CT); Series: ERJ; Part Status: Active; Value: 100k; Tolerance: ±1%; Composition: Thick Film; Features: Automotive AEC-Q200; Operating Temperature: -55°C ~ 155°C; Package / Case: 0805 (2012 Metric); Supplier Device Package: 0805; Size / Dimension: 0.079" L x 0.049" W (2.00mm x 1.25mm); Height - Seated (Max): 0.028" (0.70mm); Number of Terminations: 2; Failure Rate: -
SB5-SB36 = Solder Bridge: Circuit Breaker; Published: 24-Mar-1999; Revision: July-2002: Re-released for DXP Platform.; Publisher: Altium Limited
VR1 VR2 = LM337-Negative_Adj: Voltage Regulator; Published: 24-Mar-1999; LatestRevisionDate: 29-May-2009; LatestRevisionNote: IPC-7351 Footprint Added.; PackageReference: D2PAK; Publisher: Altium Limited; PackageDescription: 3-Pin Transistor Outline Package 2.54 mm Pitch, 15.1 mm Lead Span

## Sheet PCIE98 Break Out.SchDoc
size A3
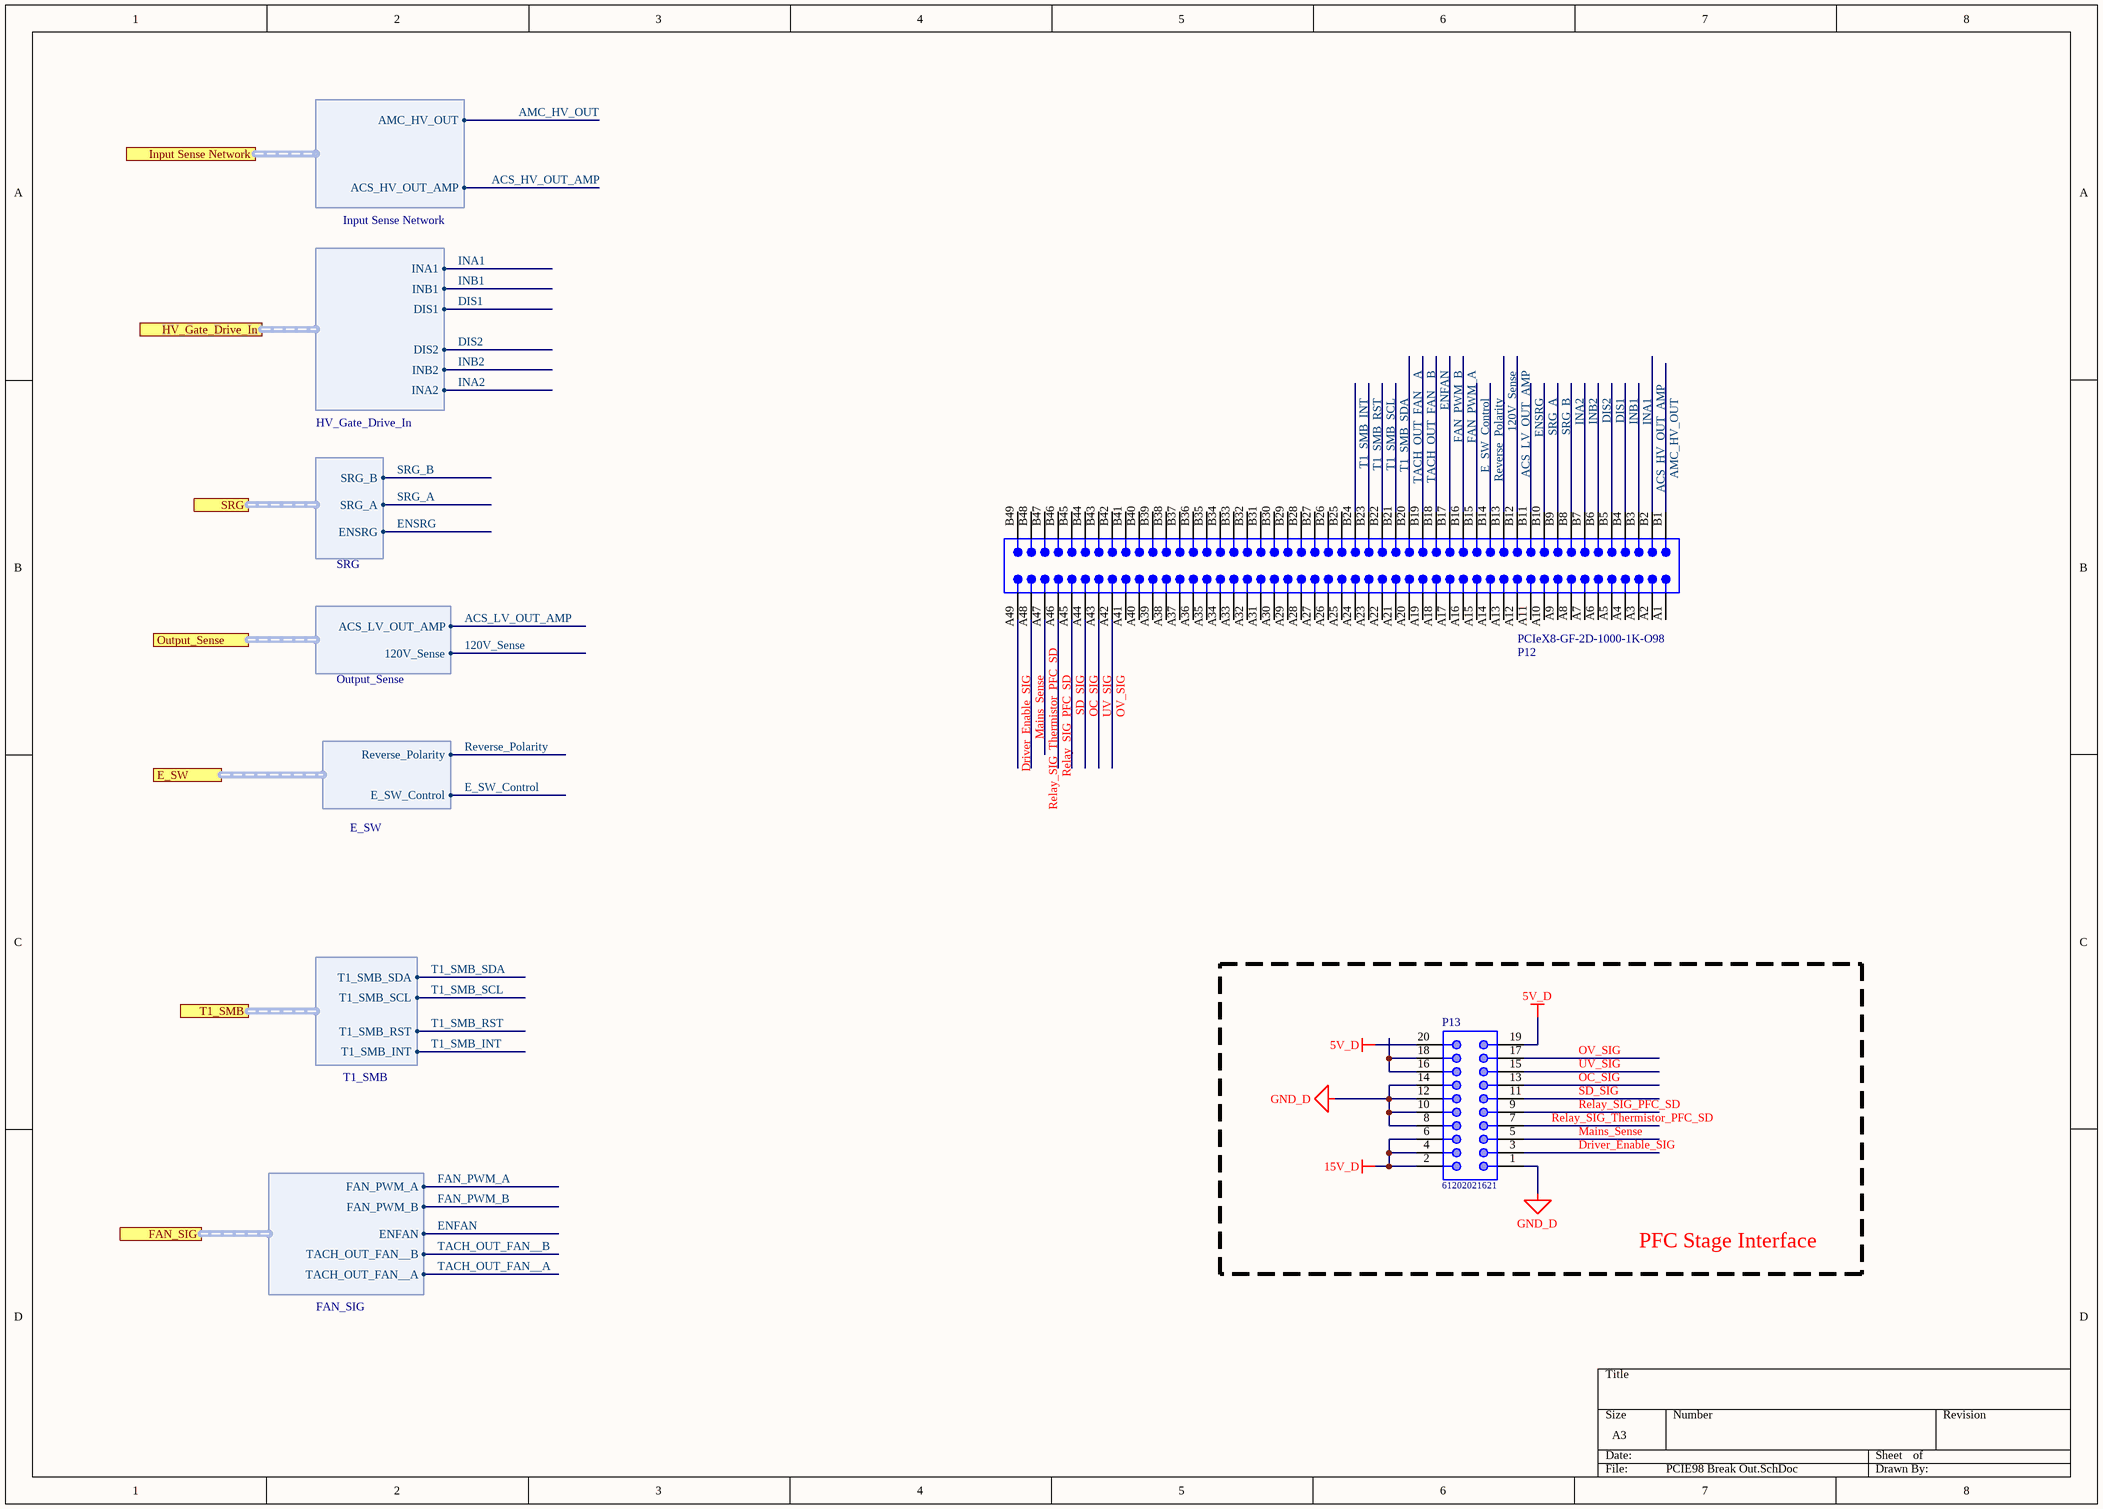
[diagram p5: PCIE98 Break Out.SchDoc]

### Parts
(Parts that share a designator on the sheet are numbered #1, #2 ... from top to bottom, then left to right.)
P12#1  PCIeX8-GF-2D-1000-1K-O98  [SMTC-PCIE-098-02-F-D-TH_V]  (no BOM)
P13#1  61202021621  [61202021621]

### Blocks framed on the sheet
PFC Stage Interface: P13#1

### Ports
E_SW (harness E_SW), FAN_SIG (harness FAN_SIG), HV_Gate_Drive_In (harness HV_Gate_Drive_In), Input Sense Network (harness Input Sense Network), Output_Sense (harness Output_Sense), SRG (harness SRG), T1_SMB (harness T1_SMB)

### Harnesses
Input Sense Network: ACS_HV_OUT_AMP, AMC_HV_OUT
HV_Gate_Drive_In: DIS1, DIS2, INA1, INA2, INB1, INB2
SRG: ENSRG, SRG_A, SRG_B
Output_Sense: 120V_Sense, ACS_LV_OUT_AMP
E_SW: E_SW_Control, Reverse_Polarity
T1_SMB: T1_SMB_INT, T1_SMB_RST, T1_SMB_SCL, T1_SMB_SDA
FAN_SIG: ENFAN, FAN_PWM_A, FAN_PWM_B, TACH_OUT_FAN__A, TACH_OUT_FAN__B

### Nets
5V_D: P13#1.19 P13#1.20
15V_D: P13#1.2 P13#1.4 P13#1.6
GND_D: P13#1.1 P13#1.8 P13#1.10 P13#1.12 P13#1.14
120V_Sense: P12#1.B13 ; port Output_Sense.120V_Sense
ACS_HV_OUT_AMP: P12#1.B2 ; port Input Sense Network.ACS_HV_OUT_AMP
ACS_LV_OUT_AMP: P12#1.B12 ; port Output_Sense.ACS_LV_OUT_AMP
AMC_HV_OUT: P12#1.B1 ; port Input Sense Network.AMC_HV_OUT
DIS1: P12#1.B5 ; port HV_Gate_Drive_In.DIS1
DIS2: P12#1.B6 ; port HV_Gate_Drive_In.DIS2
Driver_Enable_SIG: P12#1.A49 P13#1.3
E_SW_Control: P12#1.B15 ; port E_SW.E_SW_Control
ENFAN: P12#1.B18 ; port FAN_SIG.ENFAN
ENSRG: P12#1.B11 ; port SRG.ENSRG
FAN_PWM_A: P12#1.B16 ; port FAN_SIG.FAN_PWM_A
FAN_PWM_B: P12#1.B17 ; port FAN_SIG.FAN_PWM_B
INA1: P12#1.B3 ; port HV_Gate_Drive_In.INA1
INA2: P12#1.B8 ; port HV_Gate_Drive_In.INA2
INB1: P12#1.B4 ; port HV_Gate_Drive_In.INB1
INB2: P12#1.B7 ; port HV_Gate_Drive_In.INB2
Mains_Sense: P12#1.A48 P13#1.5
OC_SIG: P12#1.A44 P13#1.13
OV_SIG: P12#1.A42 P13#1.17
Relay_SIG_PFC_SD: P12#1.A46 P13#1.9
Relay_SIG_Thermistor_PFC_SD: P12#1.A47 P13#1.7
Reverse_Polarity: P12#1.B14 ; port E_SW.Reverse_Polarity
SD_SIG: P12#1.A45 P13#1.11
SRG_A: P12#1.B10 ; port SRG.SRG_A
SRG_B: P12#1.B9 ; port SRG.SRG_B
T1_SMB_INT: P12#1.B24 ; port T1_SMB.T1_SMB_INT
T1_SMB_RST: P12#1.B23 ; port T1_SMB.T1_SMB_RST
T1_SMB_SCL: P12#1.B22 ; port T1_SMB.T1_SMB_SCL
T1_SMB_SDA: P12#1.B21 ; port T1_SMB.T1_SMB_SDA
TACH_OUT_FAN__A: P12#1.B20 ; port FAN_SIG.TACH_OUT_FAN__A
TACH_OUT_FAN__B: P12#1.B19 ; port FAN_SIG.TACH_OUT_FAN__B
UV_SIG: P12#1.A43 P13#1.15
NetP13#1_16: P13#1.16 P13#1.18

Not connected (* = marked no-connect by the designer): P12#1 A1 A2 A3 A4 A5 A6 A7 A8 A9 A10 A11 A12 A13 A14 A15 A16 A17 A18 A19 A20 A21 A22 A23 A24 A25 A26 A27 A28 A29 A30 A31 A32 A33 A34 A35 A36 A37 A38 A39 A40 A41 B25 B26 B27 B28 B29 B30 B31 B32 B33 B34 B35 B36 B37 B38 B39 B40 B41 B42 B43 B44 B45 B46 B47 B48 B49

### Library data of the parts
P12#1 = PCIeX8-GF-2D-1000-1K-O98: Golden finger, PCIeX8, Dual, Opposite, Pitch 1mm, 98-Position; Mating Connector: Molex-87715-9205; Package Version: rev2.0, Apr-2007; ClassName: Edge Connector; Package Reference: GF-2D-1000-1K-O98; Datasheet Version: rev2.0, Apr-2007; Publisher: Altium
P13#1 = 61202021621: Male Box Header WR-BHD, THT, Vertical, pitch 2.54 mm, 20 pins; Pitch: 2.54 mm; Working Voltage: 250 VAC; Withstanding Voltage: 500 VAC; Contact Resistance: 20 mOhm; Pin Number: 20; ComponentLink1Description: Manufacturer; ComponentLink1URL: http://www.we-online.de; ComponentLink2Description: Datasheet; ComponentLink2URL: https://katalog.we-online.de/em/datasheet/6120xx21621.pdf; Part Number: 61202021621; Published Date: August 2018; Publisher: Wurth Elektronik; Operating Temperature: -40 to 125 degC; Packaging: Tray; Gender: Male; Mounting Technology: THT; Orientation: Vertical

## Sheet Auxillary Supply Break Out.SchDoc
size A2
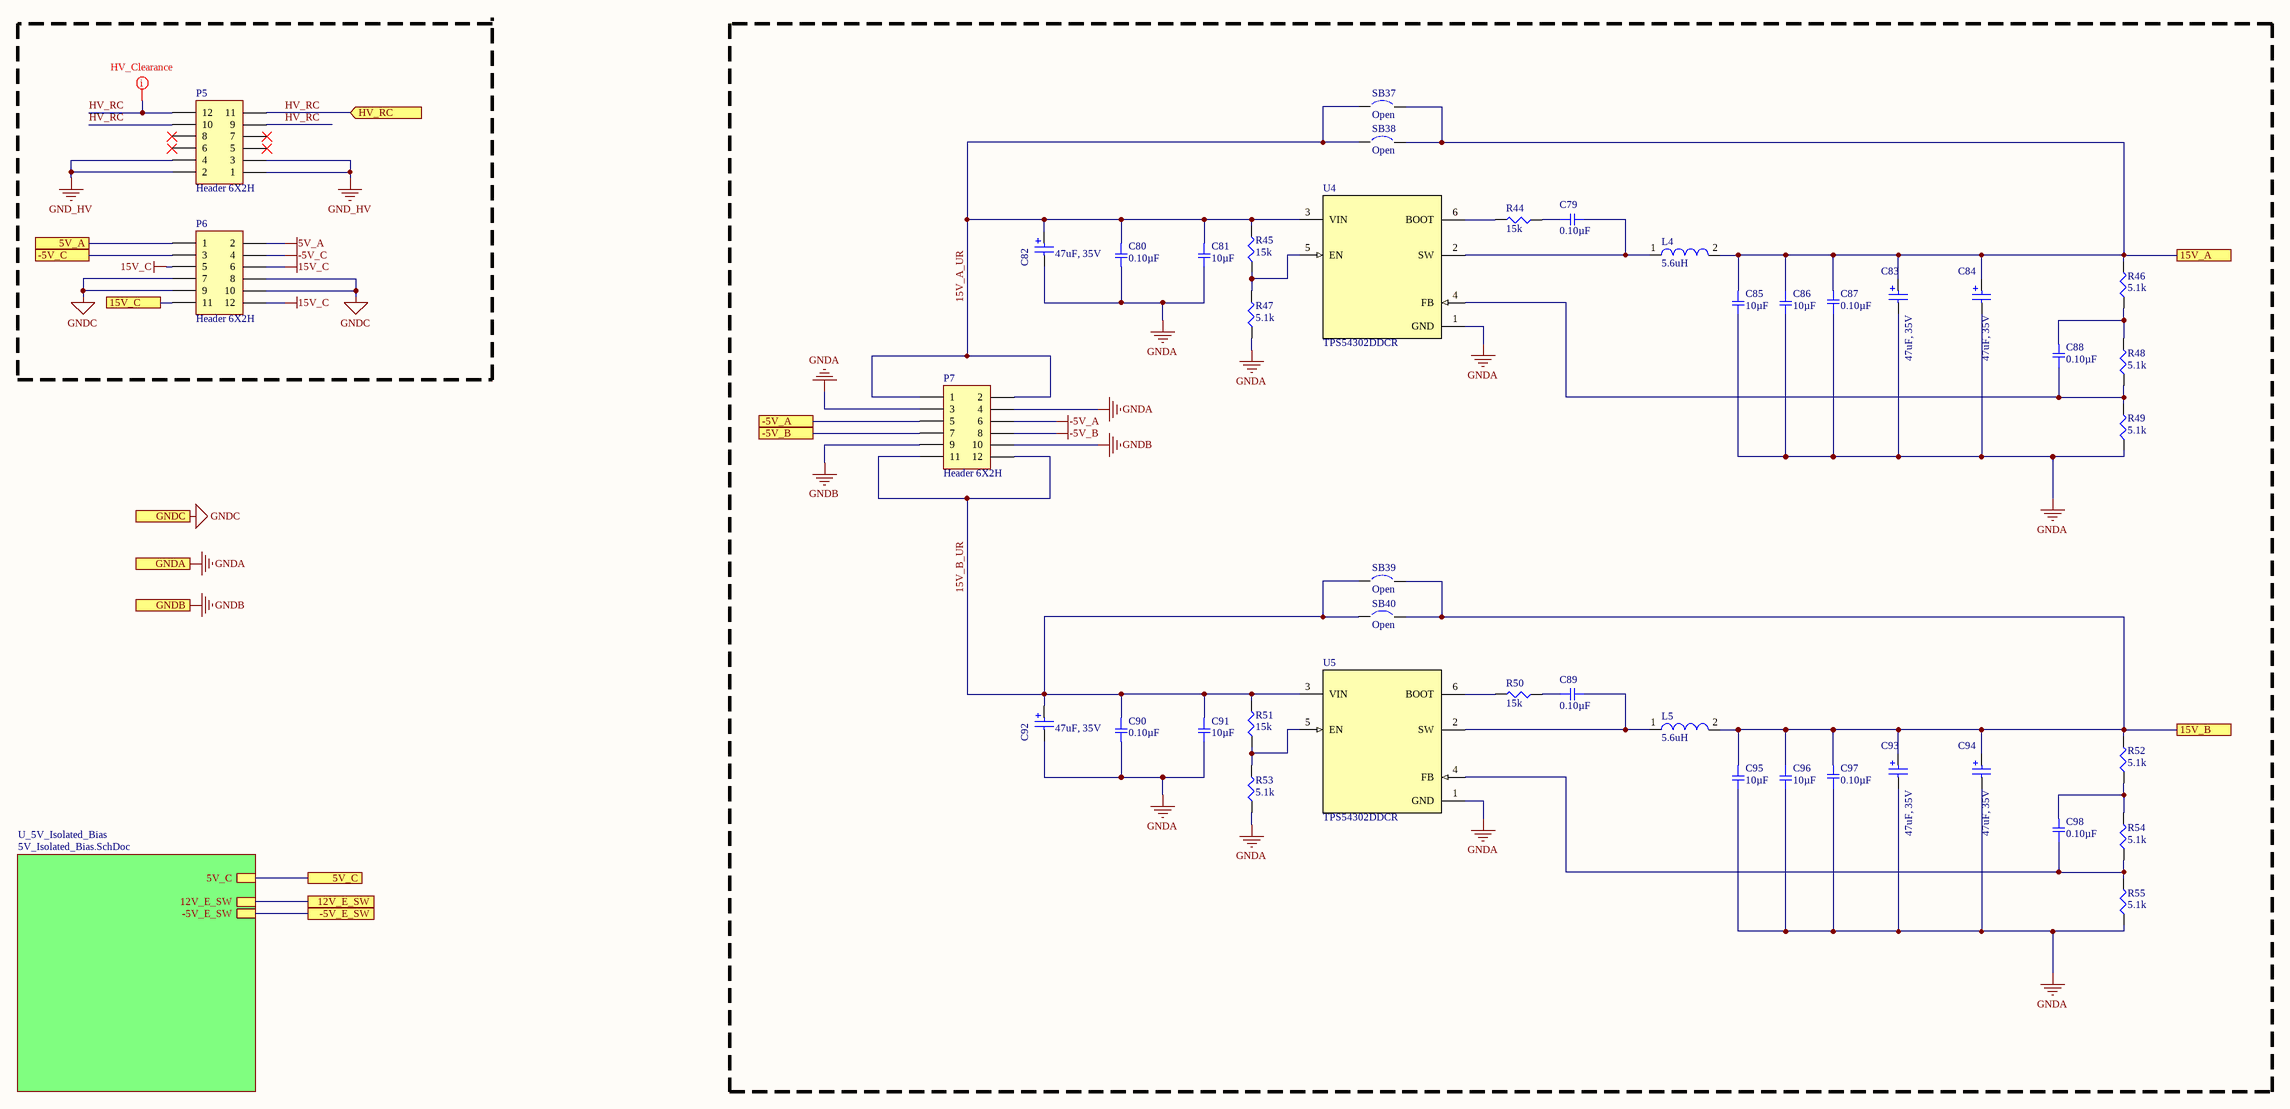
[diagram p6: Auxillary Supply Break Out.SchDoc]

### Parts
C79  0.10µF  [SMD-0805C]
C80  0.10µF  [SMD-0805C]
C81  10µF  [SMD-0805C]
C82  47uF, 35V  [WCAP-ASLU_6.3x7.7]
C83  47uF, 35V  [WCAP-ASLU_6.3x7.7]
C84  47uF, 35V  [WCAP-ASLU_6.3x7.7]
C85  10µF  [SMD-0805C]
C86  10µF  [SMD-0805C]
C87  0.10µF  [SMD-0805C]
C88  0.10µF  [SMD-0805C]
C89  0.10µF  [SMD-0805C]
C90  0.10µF  [SMD-0805C]
C91  10µF  [SMD-0805C]
C92  47uF, 35V  [WCAP-ASLU_6.3x7.7]
C93  47uF, 35V  [WCAP-ASLU_6.3x7.7]
C94  47uF, 35V  [WCAP-ASLU_6.3x7.7]
C95  10µF  [SMD-0805C]
C96  10µF  [SMD-0805C]
C97  0.10µF  [SMD-0805C]
C98  0.10µF  [SMD-0805C]
L4  5.6uH  [WE-PD-L]
L5  5.6uH  [WE-PD-L]
P5  Header 6X2H  [Stackable-Conn]
P6  Header 6X2H  [Stackable-Conn]
P7  Header 6X2H  [Stackable-Conn]
R44  15k  [SMD-0603-RES]
R45  15k  [SMD-0603-RES]
R46  5.1k  [SMD-0603-RES]
R47  5.1k  [SMD-0603-RES]
R48  5.1k  [SMD-0603-RES]
R49  5.1k  [SMD-0603-RES]
R50  15k  [SMD-0603-RES]
R51  15k  [SMD-0603-RES]
R52  5.1k  [SMD-0603-RES]
R53  5.1k  [SMD-0603-RES]
R54  5.1k  [SMD-0603-RES]
R55  5.1k  [SMD-0603-RES]
SB37  Open  [Solder Bridge - HP]  (no BOM)
SB38  Open  [Solder Bridge - HP]  (no BOM)
SB39  Open  [Solder Bridge - HP]  (no BOM)
SB40  Open  [Solder Bridge - HP]  (no BOM)
U4  TPS54302DDCR  [SOT95P278X110-6N]
U5  TPS54302DDCR  [SOT95P278X110-6N]

### Sub-sheets
U_5V_Isolated_Bias = 5V_Isolated_Bias.SchDoc: -5V_E_SW, 12V_E_SW, 5V_C

### Ports
5V_A, 5V_C, 12V_E_SW, 15V_A, 15V_B, 15V_C, -5V_A, -5V_B, -5V_C, -5V_E_SW, GNDA, GNDB, GNDC, HV_RC (in)

### Nets
5V_A: P6.1 P6.2 ; port 5V_A
5V_C: port 5V_C, sheet U_5V_Isolated_Bias/5V_C
12V_E_SW: port 12V_E_SW, sheet U_5V_Isolated_Bias/12V_E_SW
15V_A: C83.2(P) C84.2(P) C85.1 C86.1 C87.2 L4.2 R46.2 SB37.2 SB38.2 ; port 15V_A
15V_B: C93.2(P) C94.2(P) C95.1 C96.1 C97.2 L5.2 R52.2 SB39.2 SB40.2 ; port 15V_B
15V_C: P6.5 P6.6 P6.11 P6.12 ; port 15V_C
-5V_A: P7.5 P7.6 ; port -5V_A
-5V_B: P7.7 P7.8 ; port -5V_B
-5V_C: P6.3 P6.4 ; port -5V_C
-5V_E_SW: port -5V_E_SW, sheet U_5V_Isolated_Bias/-5V_E_SW
GND_HV: P5.1 P5.2 P5.3 P5.4
GNDA: C80.2 C81.2 C82.1(N) C83.1(N) C84.1(N) C85.2 C86.2 C87.1 C90.2 C91.2 C92.1(N) C93.1(N) C94.1(N) C95.2 C96.2 C97.1 P7.3 P7.4 R47.1 R49.1 R53.1 R55.1 U4.1(GND) U5.1(GND) ; port GNDA
GNDB: P7.9 P7.10 ; port GNDB
GNDC: P6.7 P6.8 P6.9 P6.10 ; port GNDC  [project net GND_LV]
15V_A_UR: C80.1 C81.1 C82.2(P) P7.1 P7.2 R45.2 SB37.1 SB38.1 U4.3(VIN)
15V_B_UR: C90.1 C91.1 C92.2(P) P7.11 P7.12 R51.2 SB39.1 SB40.1 U5.3(VIN)
HV_RC: P5.9 P5.10 P5.11 P5.12 ; port HV_RC
NetC79_1: C79.1 R44.1
NetC79_2: C79.2 L4.1 U4.2(SW)
NetC88_1: C88.1 R48.1 R49.2 U4.4(FB)
NetC88_2: C88.2 R46.1 R48.2
NetC89_1: C89.1 R50.1
NetC89_2: C89.2 L5.1 U5.2(SW)
NetC98_1: C98.1 R54.1 R55.2 U5.4(FB)
NetC98_2: C98.2 R52.1 R54.2
NetR44_2: R44.2 U4.6(BOOT)
NetR45_1: R45.1 R47.2 U4.5(EN)
NetR50_2: R50.2 U5.6(BOOT)
NetR51_1: R51.1 R53.2 U5.5(EN)

Not connected (* = marked no-connect by the designer): P5 5* 6* 7* 8*

### Layout directives
rule Clearance Constraint [Generic clearance = 50mil, and 30 value(s) for objects]: HV_RC

### Library data of the parts
C79 C80 C87-C90 C97 C98 = GCD21BR71H104KA01L: CAP CER 0.1UF 50V X7R 0805; Manufacturer: Murata Electronics North America; Factory Stock: 0; Unit Price (USD): 0.24; Minimum Quantity: 1; Tolerance: ±10%; Datasheets: http://www.murata.com/~/media/webrenewal/support/library/catalog/products/capacitor/mlcc/c03e.ashx; Image: //media.digikey.com/Renders/Murata%20Renders/0805%28GxM6%29.jpg; Digi-Key Part Number: 490-11955-1-ND; Part Number: GCD21BR71H104KA01L; Quantity Available: 157; @ qty: 0; Packaging: Cut Tape (CT); Series: GCD; Part Status: Active; Value: 0.10µF; Voltage: 50V; Temperature Coefficient: X7R; Operating Temperature: -55°C ~ 125°C; Features: -; Ratings: AEC-Q200; Applications: Automotive; Mounting Type: Surface Mount, MLCC; Package / Case: 0805 (2012 Metric); Size / Dimension: 0.079" L x 0.049" W (2.00mm x 1.25mm); Height - Seated (Max): -; Thickness (Max): 0.049" (1.25mm); Lead Spacing: -; Lead Style: -
C81 C85 C86 C91 C95 C96 = GRM219R61E106KA12D: CAP CER 10UF 25V X5R 0805; Manufacturer: Murata Electronics North America; Factory Stock: 0; Unit Price (USD): 0.24; Minimum Quantity: 1; Tolerance: ±10%; Datasheets: http://www.murata.com/~/media/webrenewal/support/library/catalog/products/capacitor/mlcc/c02e.pdf; Image: //media.digikey.com/Renders/Murata%20Renders/0805%20(2012%20Metric)%20.85mm.jpg; Digi-Key Part Number: 490-7207-1-ND; Part Number: GRM219R61E106KA12D; Quantity Available: 109571; @ qty: 0; Packaging: Cut Tape (CT); Series: GRM; Part Status: Active; Value: 10µF; Voltage: 25V; Temperature Coefficient: X5R; Operating Temperature: -55°C ~ 85°C; Features: Derating Recommended; Ratings: -; Applications: General Purpose; Mounting Type: Surface Mount, MLCC; Package / Case: 0805 (2012 Metric); Size / Dimension: 0.079" L x 0.049" W (2.01mm x 1.25mm); Height - Seated (Max): -; Thickness (Max): 0.037" (0.95mm); Lead Spacing: -; Lead Style: -
C82-C84 C92-C94 = 865090545008: WCAP-ASLU Aluminium Electrolytic Capacitors, D6.3mm x L7.7mm, 47uF, +/-20%, 35VDC; Dissipation Factor: 14%; Leakage Current: 3.29uA; Endurance: 1000h; Technical Reference: ASBD077470M035DVCTCA000; Ripple Current max.: 75mA; ComponentLink1Description: Manufacturer; ComponentLink1URL: http://www.we-online.de; ComponentLink2Description: Datasheet; ComponentLink2URL: https://katalog.we-online.com/pbs/datasheet/865090545008.pdf; Mounting Technology: SMD; Operating Temperature: -40 to +85degC; Packaging: Tape and Reel; Part Number: 865090545008; Publisher: Wurth Elektronik; Capacitance: 47uF; Diameter: 6.3mm; Length: 7.7mm; Published Date: August 2019; Rated Voltage: 35VDC; Capacitance Tolerance: +/-20%
L4 L5 = CMP-0227-00698-1: SMD-Shielded Power Inductor WE-PD, L = 4.70 µH; Inductance: 4.70 ÂµH; ComponentLink1Description: Manufacturer Link; ComponentLink2Description: Datasheet; ComponentLink2URL: http://www.we-online.de/katalog/media/pdf/744771004.pdf; PackageReference: WE-PD-L; ComponentLink1URL: http://www.we-online.com; DatasheetVersion: ver 7, Sep-2006; PackageDescription: SMD Inductor, 2-Leads, Body 12.0 x 12.0 mm; PackageVersion: 2006
P5-P7 = Header 6X2H: Header, 6-Pin, Dual row, Right Angle; LatestRevisionDate: 17-Jul-2002; LatestRevisionNote: Re-released for DXP Platform.; Publisher: Altium Limited
R44 R45 R50 R51 = ERJ-3EKF1502V: RES SMD 15K OHM 1% 1/10W 0603; Manufacturer: Panasonic Electronic Components; Factory Stock: 0; Unit Price (USD): 0.00379; @ qty: 1500; Minimum Quantity: 1; Power (Watts): 0.1W, 1/10W; Temperature Coefficient: ±100ppm/°C; Part Number: ERJ-3EKF1502V; Datasheets: http://industrial.panasonic.com/www-cgi/jvcr13pz.cgi?E+PZ+3+AOA0002+ERJ3EKF1502V+7+WW; Image: //media.digikey.com/Photos/Panasonic%20Photos/MFG_ERJ-P6W%20Series.jpg; Digi-Key Part Number: P15.0KHCT-ND; Quantity Available: 660470; Packaging: Cut Tape (CT); Series: ERJ; Part Status: Active; Value: 15k; Tolerance: ±1%; Composition: Thick Film; Features: Automotive AEC-Q200; Operating Temperature: -55°C ~ 155°C; Package / Case: 0603 (1608 Metric); Supplier Device Package: 0603; Size / Dimension: 0.063" L x 0.031" W (1.60mm x 0.80mm); Height - Seated (Max): 0.022" (0.55mm); Number of Terminations: 2; Failure Rate: -
R46-R49 R52-R55 = ERJ-3EKF5101V: RES SMD 5.1K OHM 1% 1/10W 0603; Manufacturer: Panasonic Electronic Components; Factory Stock: 0; Unit Price (USD): 0.00379; @ qty: 1500; Minimum Quantity: 1; Power (Watts): 0.1W, 1/10W; Temperature Coefficient: ±100ppm/°C; Part Number: ERJ-3EKF5101V; Datasheets: http://industrial.panasonic.com/www-cgi/jvcr13pz.cgi?E+PZ+3+AOA0002+ERJ3EKF5101V+7+WW; Image: //media.digikey.com/Photos/Panasonic%20Photos/MFG_ERJ-P6W%20Series.jpg; Digi-Key Part Number: P5.10KHCT-ND; Quantity Available: 159646; Packaging: Cut Tape (CT); Series: ERJ; Part Status: Active; Value: 5.1k; Tolerance: ±1%; Composition: Thick Film; Features: Automotive AEC-Q200; Operating Temperature: -55°C ~ 155°C; Package / Case: 0603 (1608 Metric); Supplier Device Package: 0603; Size / Dimension: 0.063" L x 0.031" W (1.60mm x 0.80mm); Height - Seated (Max): 0.022" (0.55mm); Number of Terminations: 2; Failure Rate: -
SB37-SB40 = Solder Bridge: Circuit Breaker; Published: 24-Mar-1999; Revision: July-2002: Re-released for DXP Platform.; Publisher: Altium Limited
U4 U5 = TPS54302DDCR: Imported; Manufacturer: Texas Instruments; PartNumber: TPS54302DDC; RefDes: RefDes; TYPE: TYPE; Value: Value; Manufacturer_Part_Number: TPS54302DDCR; Manufacturer_Name: Texas Instruments